# EAGLE design RQ2_mainboard_v0.2 (EAGLE 7.7.0)
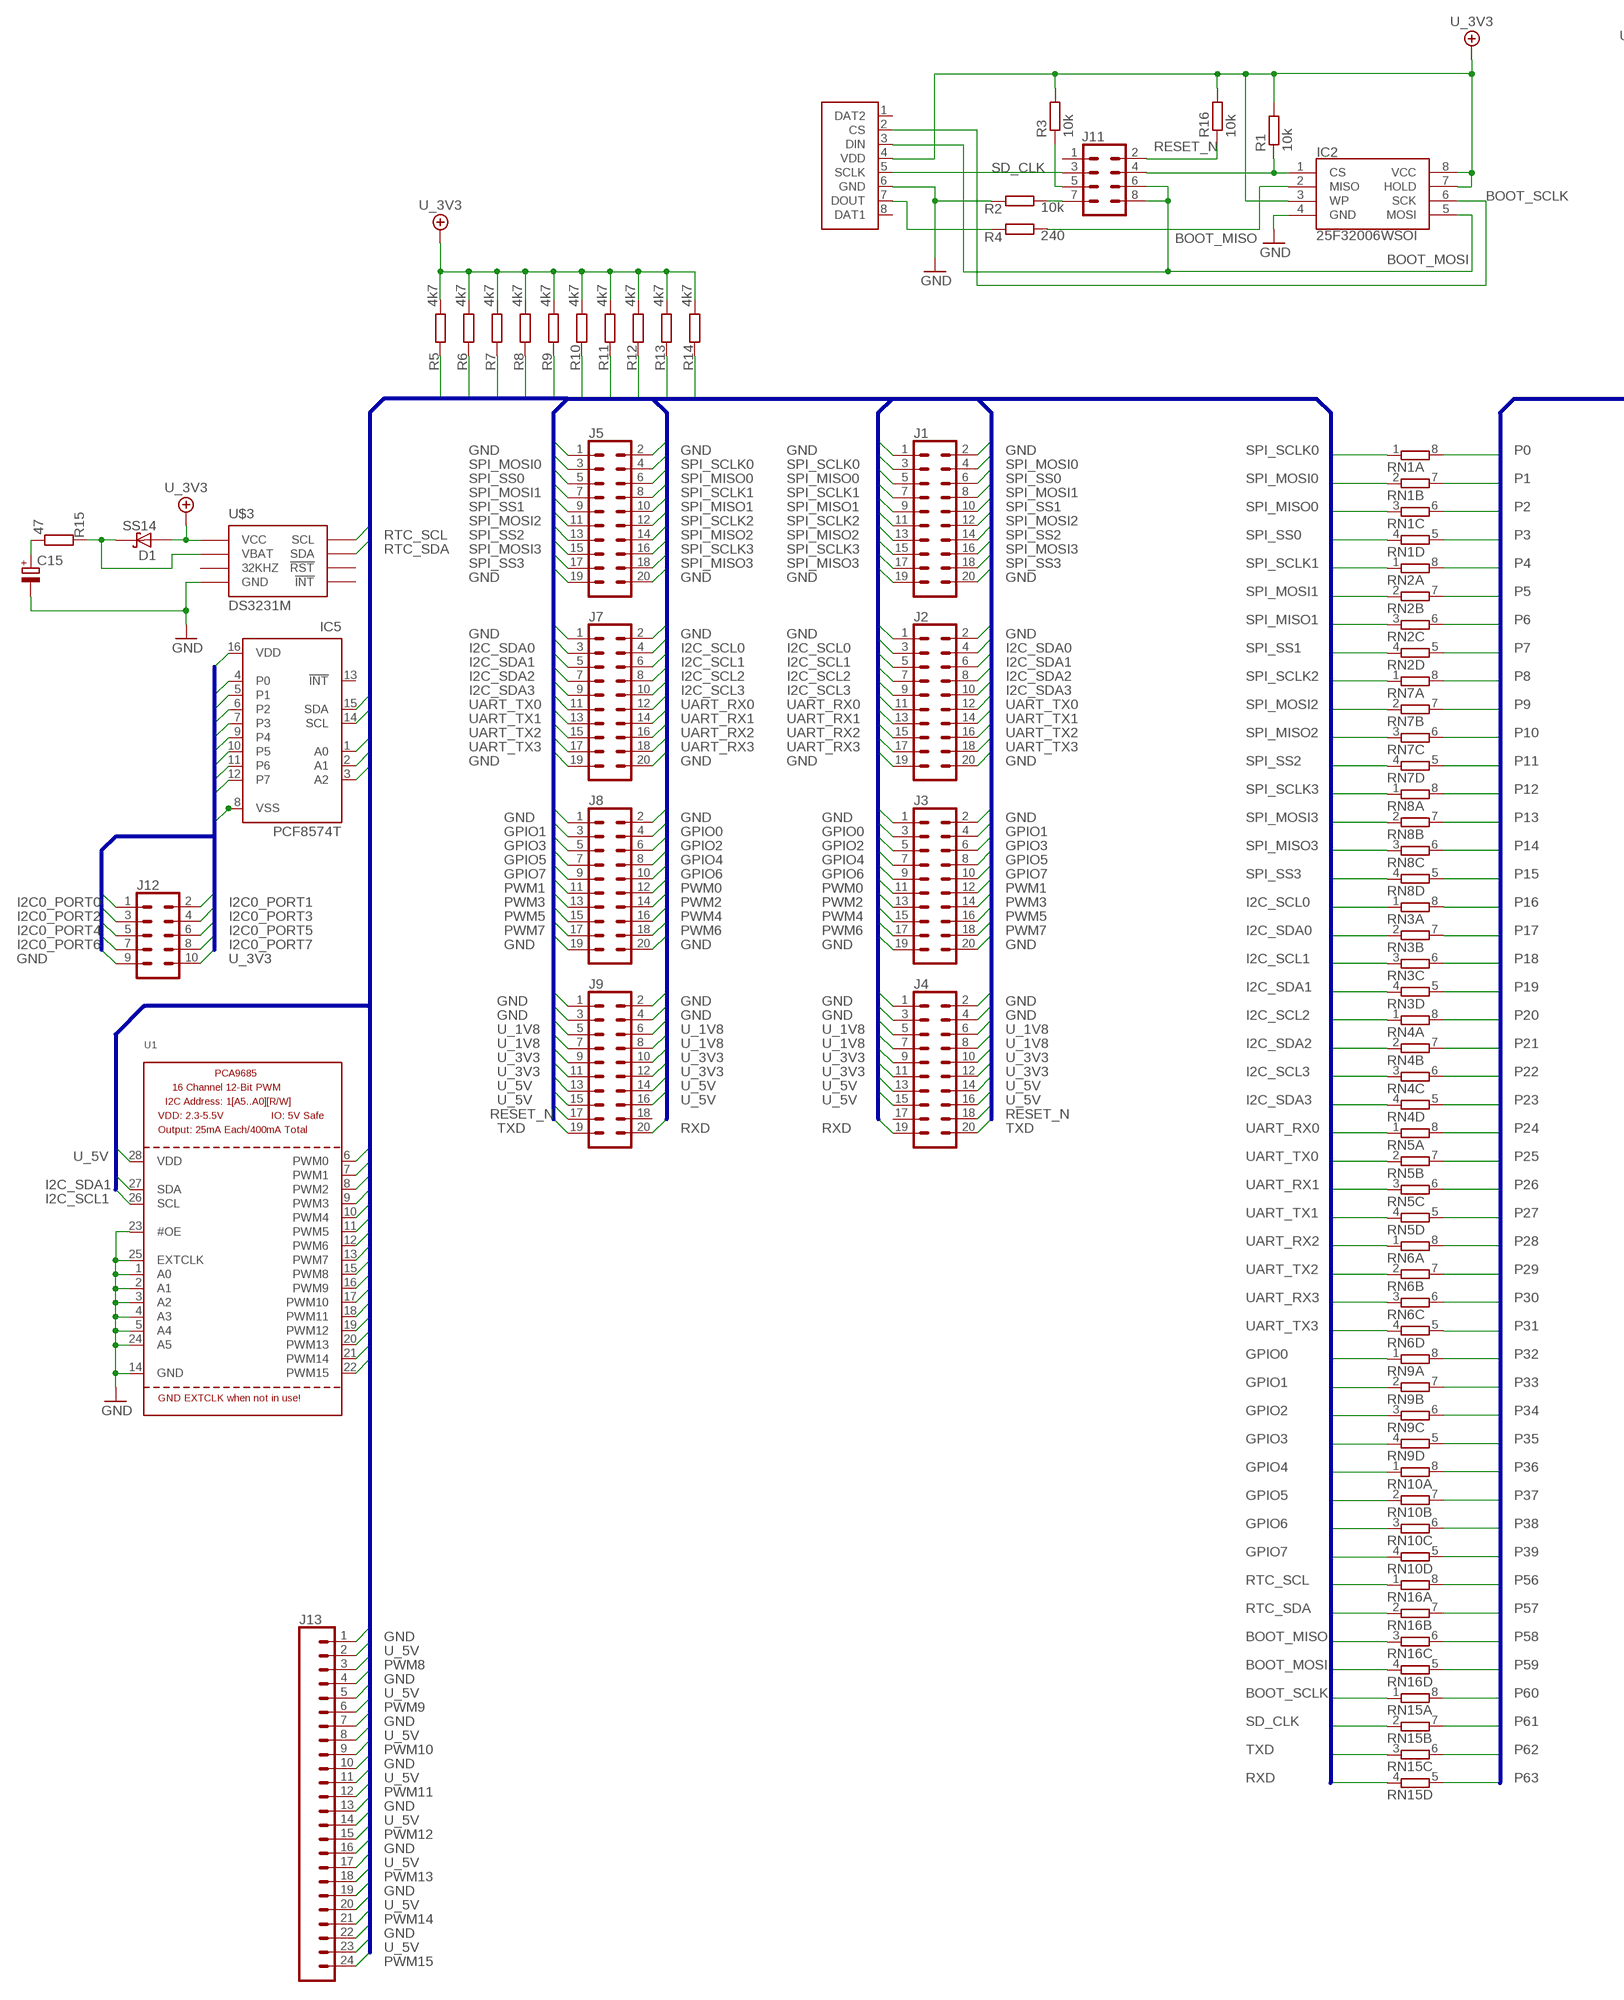
[diagram p0: schematic, sheet 1, part 1 of 2]
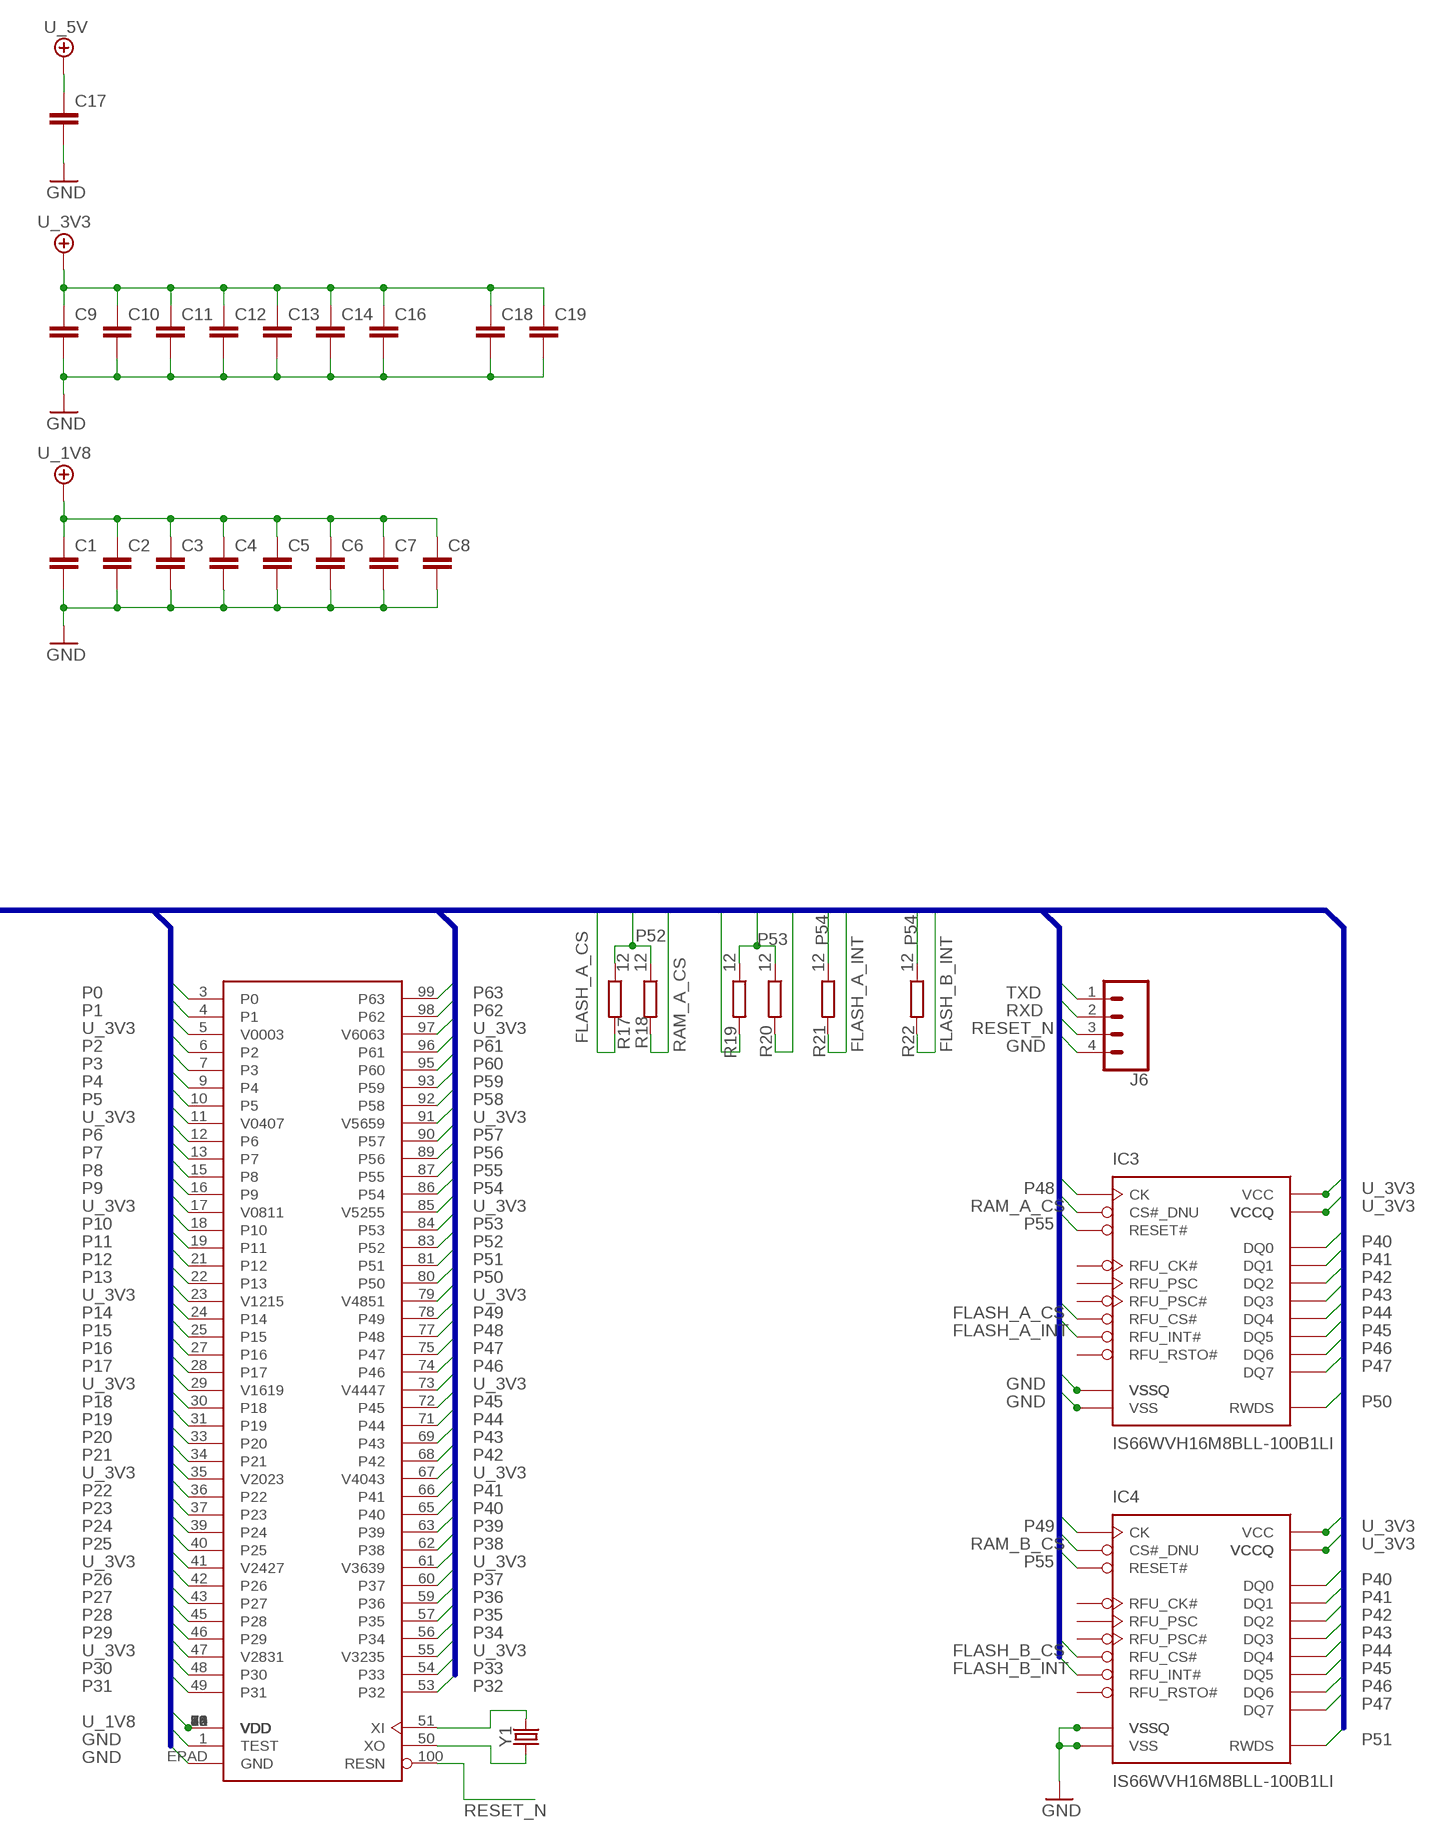
[diagram p1: schematic, sheet 1, part 2 of 2]

## Parts
C1  C-EUC0805  [C0805]
C2  C-EUC0805  [C0805]
C3  C-EUC0805  [C0805]
C4  C-EUC0805  [C0805]
C5  C-EUC0805  [C0805]
C6  C-EUC0805  [C0805]
C7  C-EUC0805  [C0805]
C8  C-EUC0805  [C0805]
C9  C-EUC0805  [C0805]
C10  C-EUC0805  [C0805]
C11  C-EUC0805  [C0805]
C12  C-EUC0805  [C0805]
C13  C-EUC0805  [C0805]
C14  C-EUC0805  [C0805]
C15  CPOL-EUDHL_21.5  [DHL_21.5]
C16  C-EUC0805  [C0805]
C17  C-EUC0805  [C0805]
C18  C-EUC0805  [C0805]
C19  C-EUC0805  [C0805]
D1  SS14  [SMA_403D]
IC1  P2X8C4M64P  [TQFP100]
IC2  25F32006WSOI  SPI_FLASH-X25XXSMD1  [SO08-EIAJ]
IC3  IS66WVH16M8BLL-100B1LI  [BGA-24]
IC4  IS66WVH16M8BLL-100B1LI  [BGA-24]
IC5  PCF8574T  [SO16W]
J1  CONN_10X2SMT  [2X10_SMT]
J2  CONN_10X2SMT  [2X10_SMT]
J3  CONN_10X2SMT  [2X10_SMT]
J4  CONN_10X2SMT  [2X10_SMT]
J5  CONN_10X2SMT  [2X10_SMT]
J6  CONN_04  [1X04]
J7  CONN_10X2SMT  [2X10_SMT]
J8  CONN_10X2SMT  [2X10_SMT]
J9  CONN_10X2SMT  [2X10_SMT]
J11  CONN_04X2  [2X4]
J12  CONN_05X2SHD  [2X5-SHROUDED]
J13  CONN_24SERVO_8  [3X8]
R1  10k  R-EU_R0603  [R0603]
R2  10k  R-EU_R0603  [R0603]
R3  10k  R-EU_R0603  [R0603]
R4  240  R-EU_R0603  [R0603]
R5  4k7  R-EU_R0603  [R0603]
R6  4k7  R-EU_R0603  [R0603]
R7  4k7  R-EU_R0603  [R0603]
R8  4k7  R-EU_R0603  [R0603]
R9  4k7  R-EU_R0603  [R0603]
R10  4k7  R-EU_R0603  [R0603]
R11  4k7  R-EU_R0603  [R0603]
R12  4k7  R-EU_R0603  [R0603]
R13  4k7  R-EU_R0603  [R0603]
R14  4k7  R-EU_R0603  [R0603]
R15  47  R-EU_R0603  [R0603]
R16  10k  R-EU_R0603  [R0603]
R17  12  R-EU_R0402  [R0402]
R18  12  R-EU_R0402  [R0402]
R19  12  R-EU_R0402  [R0402]
R20  12  R-EU_R0402  [R0402]
R21  12  R-EU_R0402  [R0402]
R22  12  R-EU_R0402  [R0402]
RN1  4R-N0603-ARV  [0603-ARV]
RN2  4R-N0603-ARV  [0603-ARV]
RN3  4R-N0603-ARV  [0603-ARV]
RN4  4R-N0603-ARV  [0603-ARV]
RN5  4R-N0603-ARV  [0603-ARV]
RN6  4R-N0603-ARV  [0603-ARV]
RN7  4R-N0603-ARV  [0603-ARV]
RN8  4R-N0603-ARV  [0603-ARV]
RN9  4R-N0603-ARV  [0603-ARV]
RN10  4R-N0603-ARV  [0603-ARV]
RN15  4R-N0603-ARV  [0603-ARV]
RN16  4R-N0603-ARV  [0603-ARV]
U1  PCA9685  [TSSOP28]
U$2  MICRO_SD_CONNECTORMOLEX_HINGE  [MICRO_SD]
U$3  DS3231M  [SO-8]
Y1  CRYSTALSMD-5X3.2-2PAD  [CRYSTAL-SMD-5X3.2-2PAD]

## Nets
BOOT_MISO: IC2.2(MISO) R4.1 RN16.3
BOOT_MOSI: IC2.5(MOSI) J11.6 J11.8 RN16.4 U$2.3(DIN)
BOOT_SCLK: IC2.6(SCK) RN15.1 U$2.2(CS)
FLASH_A_CS: IC3.C2(RFU_CS#) R17.2
FLASH_A_INT: IC3.A5(RFU_INT#) R21.2
FLASH_B_CS: IC4.C2(RFU_CS#) R19.2
FLASH_B_INT: IC4.A5(RFU_INT#) R22.2
FLASH_CS: IC2.1(CS) J11.4 R1.1
GND: C1.2 C2.2 C3.2 C4.2 C5.2 C6.2 C7.2 C8.2 C9.2 C10.2 C11.2 C12.2 C13.2 C14.2 C15.- C16.2 C17.2 C18.2 C19.2 IC1.1(TEST) IC1.EPAD(GND) IC2.4(GND) IC3.B3(VSS) IC3.C1(VSSQ) IC3.E5(VSSQ) IC4.B3(VSS) IC4.C1(VSSQ) IC4.E5(VSSQ) IC5.1(A0) IC5.2(A1) IC5.3(A2) IC5.8(VSS) J1.1 J1.2 J1.19 J1.20 J2.1 J2.2 J2.19 J2.20 J3.1 J3.2 J3.19 J3.20 J4.1 J4.2 J4.3 J4.4 J5.1 J5.2 J5.19 J5.20 J6.4 J7.1 J7.2 J7.19 J7.20 J8.1 J8.2 J8.19 J8.20 J9.1 J9.2 J9.3 J9.4 J12.9 J13.1 J13.4 J13.7 J13.10 J13.13 J13.16 J13.19 J13.22 R2.2 U1.1(A0) U1.2(A1) U1.3(A2) U1.4(A3) U1.5(A4) U1.14(GND) U1.23(#OE) U1.24(A5) U1.25(EXTCLK) U$2.6(GND) U$3.5(GND)
GPIO0: J3.3 J8.4 RN9.1
GPIO1: J3.4 J8.3 RN9.2
GPIO2: J3.5 J8.6 RN9.3
GPIO3: J3.6 J8.5 RN9.4
GPIO4: J3.7 J8.8 RN10.1
GPIO5: J3.8 J8.7 RN10.2
GPIO6: J3.9 J8.10 RN10.3
GPIO7: J3.10 J8.9 RN10.4
I2C0_PORT0: IC5.4(P0) J12.1
I2C0_PORT1: IC5.5(P1) J12.2
I2C0_PORT2: IC5.6(P2) J12.3
I2C0_PORT3: IC5.7(P3) J12.4
I2C0_PORT4: IC5.9(P4) J12.5
I2C0_PORT5: IC5.10(P5) J12.6
I2C0_PORT6: IC5.11(P6) J12.7
I2C0_PORT7: IC5.12(P7) J12.8
I2C_SCL0: IC5.14(SCL) J2.3 J7.4 R5.1 RN3.1
I2C_SCL1: J2.5 J7.6 R7.1 RN3.3 U1.26(SCL)
I2C_SCL2: J2.7 J7.8 R9.1 RN4.1
I2C_SCL3: J2.9 J7.10 R11.1 RN4.3
I2C_SDA0: IC5.15(SDA) J2.4 J7.3 R6.1 RN3.2
I2C_SDA1: J2.6 J7.5 R8.1 RN3.4 U1.27(SDA)
I2C_SDA2: J2.8 J7.7 R10.1 RN4.2
I2C_SDA3: J2.10 J7.9 R12.1 RN4.4
N$7: J11.7 R2.1
N$8: J11.5 R3.1
N$10: R4.2 U$2.7(DOUT)
P0: IC1.3(P0) RN1.8
P1: IC1.4(P1) RN1.7
P2: IC1.6(P2) RN1.6
P3: IC1.7(P3) RN1.5
P4: IC1.9(P4) RN2.8
P5: IC1.10(P5) RN2.7
P6: IC1.12(P6) RN2.6
P7: IC1.13(P7) RN2.5
P8: IC1.15(P8) RN7.8
P9: IC1.16(P9) RN7.7
P10: IC1.18(P10) RN7.6
P11: IC1.19(P11) RN7.5
P12: IC1.21(P12) RN8.8
P13: IC1.22(P13) RN8.7
P14: IC1.24(P14) RN8.6
P15: IC1.25(P15) RN8.5
P16: IC1.27(P16) RN3.8
P17: IC1.28(P17) RN3.7
P18: IC1.30(P18) RN3.6
P19: IC1.31(P19) RN3.5
P20: IC1.33(P20) RN4.8
P21: IC1.34(P21) RN4.7
P22: IC1.36(P22) RN4.6
P23: IC1.37(P23) RN4.5
P24: IC1.39(P24) RN5.8
P25: IC1.40(P25) RN5.7
P26: IC1.42(P26) RN5.6
P27: IC1.43(P27) RN5.5
P28: IC1.45(P28) RN6.8
P29: IC1.46(P29) RN6.7
P30: IC1.48(P30) RN6.6
P31: IC1.49(P31) RN6.5
P32: IC1.53(P32) RN9.8
P33: IC1.54(P33) RN9.7
P34: IC1.56(P34) RN9.6
P35: IC1.57(P35) RN9.5
P36: IC1.59(P36) RN10.8
P37: IC1.60(P37) RN10.7
P38: IC1.62(P38) RN10.6
P39: IC1.63(P39) RN10.5
P40: IC1.65(P40) IC3.D3(DQ0) IC4.D3(DQ0)
P41: IC1.66(P41) IC3.D2(DQ1) IC4.D2(DQ1)
P42: IC1.68(P42) IC3.C4(DQ2) IC4.C4(DQ2)
P43: IC1.69(P43) IC3.D4(DQ3) IC4.D4(DQ3)
P44: IC1.71(P44) IC3.D5(DQ4) IC4.D5(DQ4)
P45: IC1.72(P45) IC3.E3(DQ5) IC4.E3(DQ5)
P46: IC1.74(P46) IC3.E2(DQ6) IC4.E2(DQ6)
P47: IC1.75(P47) IC3.E1(DQ7) IC4.E1(DQ7)
P48: IC1.77(P48) IC3.B2(CK)
P49: IC1.78(P49) IC4.B2(CK)
P50: IC1.80(P50) IC3.C3(RWDS)
P51: IC1.81(P51) IC4.C3(RWDS)
P52: IC1.83(P52) R17.1 R18.1
P53: IC1.84(P53) R19.1 R20.1
P54: IC1.86(P54) R21.1 R22.1
P55: IC1.87(P55) IC3.A4(RESET#) IC4.A4(RESET#)
P56: IC1.89(P56) RN16.8
P57: IC1.90(P57) RN16.7
P58: IC1.92(P58) RN16.6
P59: IC1.93(P59) RN16.5
P60: IC1.95(P60) RN15.8
P61: IC1.96(P61) RN15.7
P62: IC1.98(P62) RN15.6
P63: IC1.99(P63) RN15.5
PWM0: J3.11 J8.12 U1.6(PWM0)
PWM1: J3.12 J8.11 U1.7(PWM1)
PWM2: J3.13 J8.14 U1.8(PWM2)
PWM3: J3.14 J8.13 U1.9(PWM3)
PWM4: J3.15 J8.16 U1.10(PWM4)
PWM5: J3.16 J8.15 U1.11(PWM5)
PWM6: J3.17 J8.18 U1.12(PWM6)
PWM7: J3.18 J8.17 U1.13(PWM7)
PWM8: J13.3 U1.15(PWM8)
PWM9: J13.6 U1.16(PWM9)
PWM10: J13.9 U1.17(PWM10)
PWM11: J13.12 U1.18(PWM11)
PWM12: J13.15 U1.19(PWM12)
PWM13: J13.18 U1.20(PWM13)
PWM14: J13.21 U1.21(PWM14)
PWM15: J13.24 U1.22(PWM15)
RAM_A_CS: IC3.A3(CS#_DNU) R18.2
RAM_B_CS: IC4.A3(CS#_DNU) R20.2
RESET_N: IC1.100(RESN) J4.18 J6.3 J9.17 J11.2 R16.1
RTC_SCL: R13.1 RN16.1 U$3.8(SCL)
RTC_SDA: R14.1 RN16.2 U$3.7(SDA)
RXD: J4.19 J6.2 J9.20 RN15.4
SD_CLK: J11.3 RN15.2 U$2.5(SCLK)
SPI_MISO0: J1.5 J5.6 RN1.3
SPI_MISO1: J1.9 J5.10 RN2.3
SPI_MISO2: J1.13 J5.14 RN7.3
SPI_MISO3: J1.17 J5.18 RN8.3
SPI_MOSI0: J1.4 J5.3 RN1.2
SPI_MOSI1: J1.8 J5.7 RN2.2
SPI_MOSI2: J1.12 J5.11 RN7.2
SPI_MOSI3: J1.16 J5.15 RN8.2
SPI_SCLK0: J1.3 J5.4 RN1.1
SPI_SCLK1: J1.7 J5.8 RN2.1
SPI_SCLK2: J1.11 J5.12 RN7.1
SPI_SCLK3: J1.15 J5.16 RN8.1
SPI_SS0: J1.6 J5.5 RN1.4
SPI_SS1: J1.10 J5.9 RN2.4
SPI_SS2: J1.14 J5.13 RN7.4
SPI_SS3: J1.18 J5.17 RN8.4
TXD: J4.20 J6.1 J9.19 RN15.3
U_1V8: C1.1 C2.1 C3.1 C4.1 C5.1 C6.1 C7.1 C8.1 IC1.2(VDD) J4.5 J4.6 J4.7 J4.8 J9.5 J9.6 J9.7 J9.8
U_3V3: C9.1 C10.1 C11.1 C12.1 C13.1 C14.1 C16.1 C18.1 C19.1 D1.A IC1.5(V0003) IC1.11(V0407) IC1.17(V0811) IC1.23(V1215) IC1.29(V1619) IC1.35(V2023) IC1.41(V2427) IC1.47(V2831) IC1.55(V3235) IC1.61(V3639) IC1.67(V4043) IC1.73(V4447) IC1.79(V4851) IC1.85(V5255) IC1.91(V5659) IC1.97(V6063) IC2.3(WP) IC2.7(HOLD) IC2.8(VCC) IC3.B4(VCC) IC3.D1(VCCQ) IC3.E4(VCCQ) IC4.B4(VCC) IC4.D1(VCCQ) IC4.E4(VCCQ) IC5.16(VDD) J4.9 J4.10 J4.11 J4.12 J9.9 J9.10 J9.11 J9.12 J12.10 R1.2 R3.2 R5.2 R6.2 R7.2 R8.2 R9.2 R10.2 R11.2 R12.2 R13.2 R14.2 R16.2 U$2.4(VDD) U$3.2(VCC)
U_5V: C17.1 J4.13 J4.14 J4.15 J4.16 J9.13 J9.14 J9.15 J9.16 J13.2 J13.5 J13.8 J13.11 J13.14 J13.17 J13.20 J13.23 U1.28(VDD)
UART_RX0: J2.11 J7.12 RN5.1
UART_RX1: J2.13 J7.14 RN5.3
UART_RX2: J2.15 J7.16 RN6.1
UART_RX3: J2.17 J7.18 RN6.3
UART_TX0: J2.12 J7.11 RN5.2
UART_TX1: J2.14 J7.13 RN5.4
UART_TX2: J2.16 J7.15 RN6.2
UART_TX3: J2.18 J7.17 RN6.4
VBAT: D1.C R15.1 U$3.6(VBAT)
VCAP: C15.+ R15.2
XIN: IC1.51(XI) Y1.P$2
XOUT: IC1.50(XO) Y1.P$1
Unconnected: IC3.A2(RFU_RSTO#) IC3.B1(RFU_CK#) IC3.B5(RFU_PSC) IC3.C5(RFU_PSC#) IC4.A2(RFU_RSTO#) IC4.B1(RFU_CK#) IC4.B5(RFU_PSC) IC4.C5(RFU_PSC#) IC5.13(!INT) J4.17 J9.18 J11.1 U$2.1(DAT2) U$2.8(DAT1) U$3.1(32KHZ) U$3.3(!INT) U$3.4(!RST)

## Buses
P[0..63],RAM_A_CS,FLASH_A_CS,RAM_B_CS,FLASH_B_CS,FLASH_A_INT,FLASH_B_INT,SPI_SCLK[0..3],SPI_MOSI[0..3],SPI_MISO[0..3],SPI_SS[0..3],I2C_SCL[0..3],I2C_SDA[0..3],SD0_CLK,SD0_CMD,SD0_DAT[0..3],SD1_CLK,SD1_CMD,SD1_DAT[0..3],GPIO[0..15],PWM[0..7],UART_RX[0..3],UART_TX[0..3],RXD,TXD,BOOT_SCLK,BOOT_MISO,BOOT_MOSI,SD_CLK,RESET_N,XIN,XOUT,U_1V8,U_3V3,U_5V,U_IN,GND
SPI_SCLK[0..3],SPI_MOSI[0..3],SPI_MISO[0..3],SPI_SS[0..3],I2C_SCL[0..3],I2C_SDA[0..3],RTC_SCL,RTC_SDA,SD_CLK,SD_CMD,SD_DAT[0..3],GPIO[0..7],ADC[0..7],PWM[0..15],UART_RX[0..3],UART_TX[0..3],PORT[0..7],RXD,TXD,BOOT_SCLK,BOOT_MISO,BOOT_MOSI,RESET_N,XIN,XOUT,U_1V8,U_3V3,U_5V,U_IN,GND
I2C0_PORT[0..7],U_3V3,GND

## Power pins joined to a net without a drawn wire
U_1V8: IC1.8(VDD) IC1.14(VDD) IC1.20(VDD) IC1.26(VDD) IC1.32(VDD) IC1.38(VDD) IC1.44(VDD) IC1.52(VDD) IC1.58(VDD) IC1.64(VDD) IC1.70(VDD) IC1.76(VDD) IC1.82(VDD) IC1.88(VDD) IC1.94(VDD)

## Library data of the parts
C1-C14 C16-C19 = rcl:C-EU: CAPACITOR, European symbol
C15 = rcl_updated:CPOL-EU: POLARIZED CAPACITOR, European symbol
D1 = adafruit:SS14
IC1 = parallax:P2X8C4M64P
IC2 = SparkFun-IC-Memory:SPI_FLASH-X25XX: 32M Serial Flash Memory 8pin SPI Flash series x25xx. Works with devices like W25X32 and BR25L32 Datasheet <http://www.macronix.com/Lists/Datasheet/Attachments/5031/MX25L3206E,%203V,%2032Mb,%20v1.5.pdf> SparkFun Products SparkFun Venus GPS Logger <https://www.sparkfun.com/products/10920> (GPS-10920); PROD_ID: IC-09109
IC3 IC4 = parallax:IS66WVH16M8BLL-100B1LI
IC5 = micro-philips:PCF8574: I2C-Bus Remote 8-bit I/O expander http://www.semiconductors.philips.com/acrobat_download/datasheets/PCF8574_4.pdf; MPN: PCF8574T/3,512; OC_FARNELL: 1201255; OC_NEWARK: 70R6870
J1-J5 J7-J9 = SparkFun-Connectors:CONN_10X2: Multi connection point. Often used as Generic Header-pin footprint for 0.1 inch spaced/style header connections On any of the 0.1 inch spaced packages, you can populate with these: Break Away Headers - Straight <https://www.sparkfun.com/products/116> (PRT-00116) Break Away Male Headers - Right Angle <https://www.sparkfun.com/products/553> (PRT-00553) Female Headers <https://www.sparkfun.com/products/115> (PRT-00115) Break Away Headers - Machine Pin <https://www.sparkfun.com/products/117> (PRT-00117) Break Away Female Headers - Swiss Machine Pin <https://www.sparkfun.com/products/743> (PRT-00743) Special note about the "SPECIAL" package: This was SPECIALLY designed to be used with our Graphic LCD Backpack. Be sure you want to use this! It is not only staggered on each line of header holes, but IT IS ALSO offset of the center point of the top and bottom lines by 5 mil. This causes the headers to lock into place on the "standard" footprint on the LCD screen. The extra squares on the tdocu layer are there simply to reference other pins (if you were to actually populate a longer header than ten long - this is what we do with the backpacks).
J6 = SparkFun-Connectors:CONN_04: Multi connection point. Often used as Generic Header-pin footprint for 0.1 inch spaced/style header connections On any of the 0.1 inch spaced packages, you can populate with these: Break Away Headers - Straight <https://www.sparkfun.com/products/116> (PRT-00116) Break Away Male Headers - Right Angle <https://www.sparkfun.com/products/553> (PRT-00553) Female Headers <https://www.sparkfun.com/products/115> (PRT-00115) Break Away Headers - Machine Pin <https://www.sparkfun.com/products/117> (PRT-00117) Break Away Female Headers - Swiss Machine Pin <https://www.sparkfun.com/products/743> (PRT-00743) For SCREWTERMINALS and SPRING TERMINALS visit here: Screw Terimnals on SparkFun.com <https://www.sparkfun.com/search/results?term=Screw+Terminals> (5mm/3.5mm/2.54mm spacing) This device is also useful as a general connection point to wire up your design to another part of your project. Our various solder wires solder well into these plated through hole pads. Hook-Up Wire - Assortment (Stranded, 22 AWG) <https://www.sparkfun.com/products/11375> (PRT-11375) Hook-Up Wire - Assortment (Solid Core, 22 AWG) <https://www.sparkfun.com/products/11367> (PRT-11367) View the entire wire category on our website here <https://www.sparkfun.com/categories/141> Special notes: Molex polarized connector foot print use with SKU : PRT-08231 with associated crimp pins and housings. 1MM SMD Version SKU: PRT-10208; PROD_ID: CONN-09696
J11 = SparkFun-Connectors:CONN_04X2: Multi connection point. Often used as Generic Header-pin footprint for 0.1 inch spaced/style header connections On any of the 0.1 inch spaced packages, you can populate with these: Break Away Headers - Straight <https://www.sparkfun.com/products/116> (PRT-00116) Break Away Male Headers - Right Angle <https://www.sparkfun.com/products/553> (PRT-00553) Female Headers <https://www.sparkfun.com/products/115> (PRT-00115) Break Away Headers - Machine Pin <https://www.sparkfun.com/products/117> (PRT-00117) Break Away Female Headers - Swiss Machine Pin <https://www.sparkfun.com/products/743> (PRT-00743)
J12 = SparkFun-Connectors:CONN_05X2: Multi connection point. Often used as Generic Header-pin footprint for 0.1 inch spaced/style header connections For AVR SPI programming port, see special device with nice symbol: "AVR_SPI_PROG_5x2.dev" You can populate with any combo of single row headers, but if you'd like an exact match, check these: 2x5 AVR ICSP Male Header <https://www.sparkfun.com/products/778> (PRT-00778) 2x5 Pin Shrouded Header <https://www.sparkfun.com/products/8506> (PRT-08506) On any of the 0.1 inch spaced packages, you can populate with these: Break Away Headers - Straight <https://www.sparkfun.com/products/116> (PRT-00116) Break Away Male Headers - Right Angle <https://www.sparkfun.com/products/553> (PRT-00553) Female Headers <https://www.sparkfun.com/products/115> (PRT-00115) Break Away Headers - Machine Pin <https://www.sparkfun.com/products/117> (PRT-00117) Break Away Female Headers - Swiss Machine Pin <https://www.sparkfun.com/products/743> (PRT-00743) Special note: the shrouded connector mates well with our 5x2 ribbon cables: 2x5 Pin IDC Ribbon Cable <https://www.sparkfun.com/products/8535> (PRT-08535); PROD_ID: CONN-08671; SF_ID: PRT-08506
J13 = SparkFun-Connectors:CONN_24: Multi connection point. Often used as Generic Header-pin footprint for 0.1 inch spaced/style header connections On any of the 0.1 inch spaced packages, you can populate with these: Break Away Headers - Straight <https://www.sparkfun.com/products/116> (PRT-00116) Break Away Male Headers - Right Angle <https://www.sparkfun.com/products/553> (PRT-00553) Female Headers <https://www.sparkfun.com/products/115> (PRT-00115) Break Away Headers - Machine Pin <https://www.sparkfun.com/products/117> (PRT-00117) Break Away Female Headers - Swiss Machine Pin <https://www.sparkfun.com/products/743> (PRT-00743) For SCREWTERMINALS and SPRING TERMINALS visit here: Screw Terimnals on SparkFun.com <https://www.sparkfun.com/search/results?term=Screw+Terminals> (5mm/3.5mm/2.54mm spacing) This device is also useful as a general connection point to wire up your design to another part of your project. Our various solder wires solder well into these plated through hole pads. Hook-Up Wire - Assortment (Stranded, 22 AWG) <https://www.sparkfun.com/products/11375> (PRT-11375) Hook-Up Wire - Assortment (Solid Core, 22 AWG) <https://www.sparkfun.com/products/11367> (PRT-11367) View the entire wire category on our website here <https://www.sparkfun.com/categories/141> Special notes: Molex polarized connector foot print use with SKU : PRT-08231 with associated crimp pins and housings. 1MM SMD Version SKU: PRT-10208 NOTES ON THE VARIANTS LOCK and LOCK_LONGPADS... This footprint was designed to help hold the alignment of a through-hole component (i.e. 6-pin header) while soldering it into place. You may notice that each hole has been shifted either up or down by 0.005 of an inch from it's more standard position (which is a perfectly straight line). This slight alteration caused the pins (the squares in the middle) to touch the edges of the holes. Because they are alternating, it causes a "brace" to hold the component in place. 0.005 has proven to be the perfect amount of "off-center" position when using our standard breakaway headers. Although looks a little odd when you look at the bare footprint, once you have a header in there, the alteration is very hard to notice. Also,if you push a header all the way into place, it is covered up entirely on the bottom side.
R1-R22 = rcl:R-EU_: RESISTOR, European symbol
RN1-RN10 RN15 RN16 = resistor-dil:4R-N: Array Chip Resistor Source: RS Component / Phycomp; OC_FARNELL: unknown; OC_NEWARK: unknown
U1 = adafruit:PCA9685: PCA9685 - 16 Channel 12-Bit I2C PWM Controller 5.0V tolerant 16 channel, 12-bit I2C PWM controller with 25mA per output (max. 400mA total) Digikey: 568-5931-1-ND
U$2 = connector:MICRO_SD_CONNECTOR
U$3 = DS3231:DS3231M
Y1 = SparkFun-Clocks:CRYSTAL: Crystals (Generic) These are passive quartz crystals, which can be used as a clock source for a microcontroller. Crystal's are two-terminal devices. They require external "load" capacitors to generate an oscillating signal.

## Board
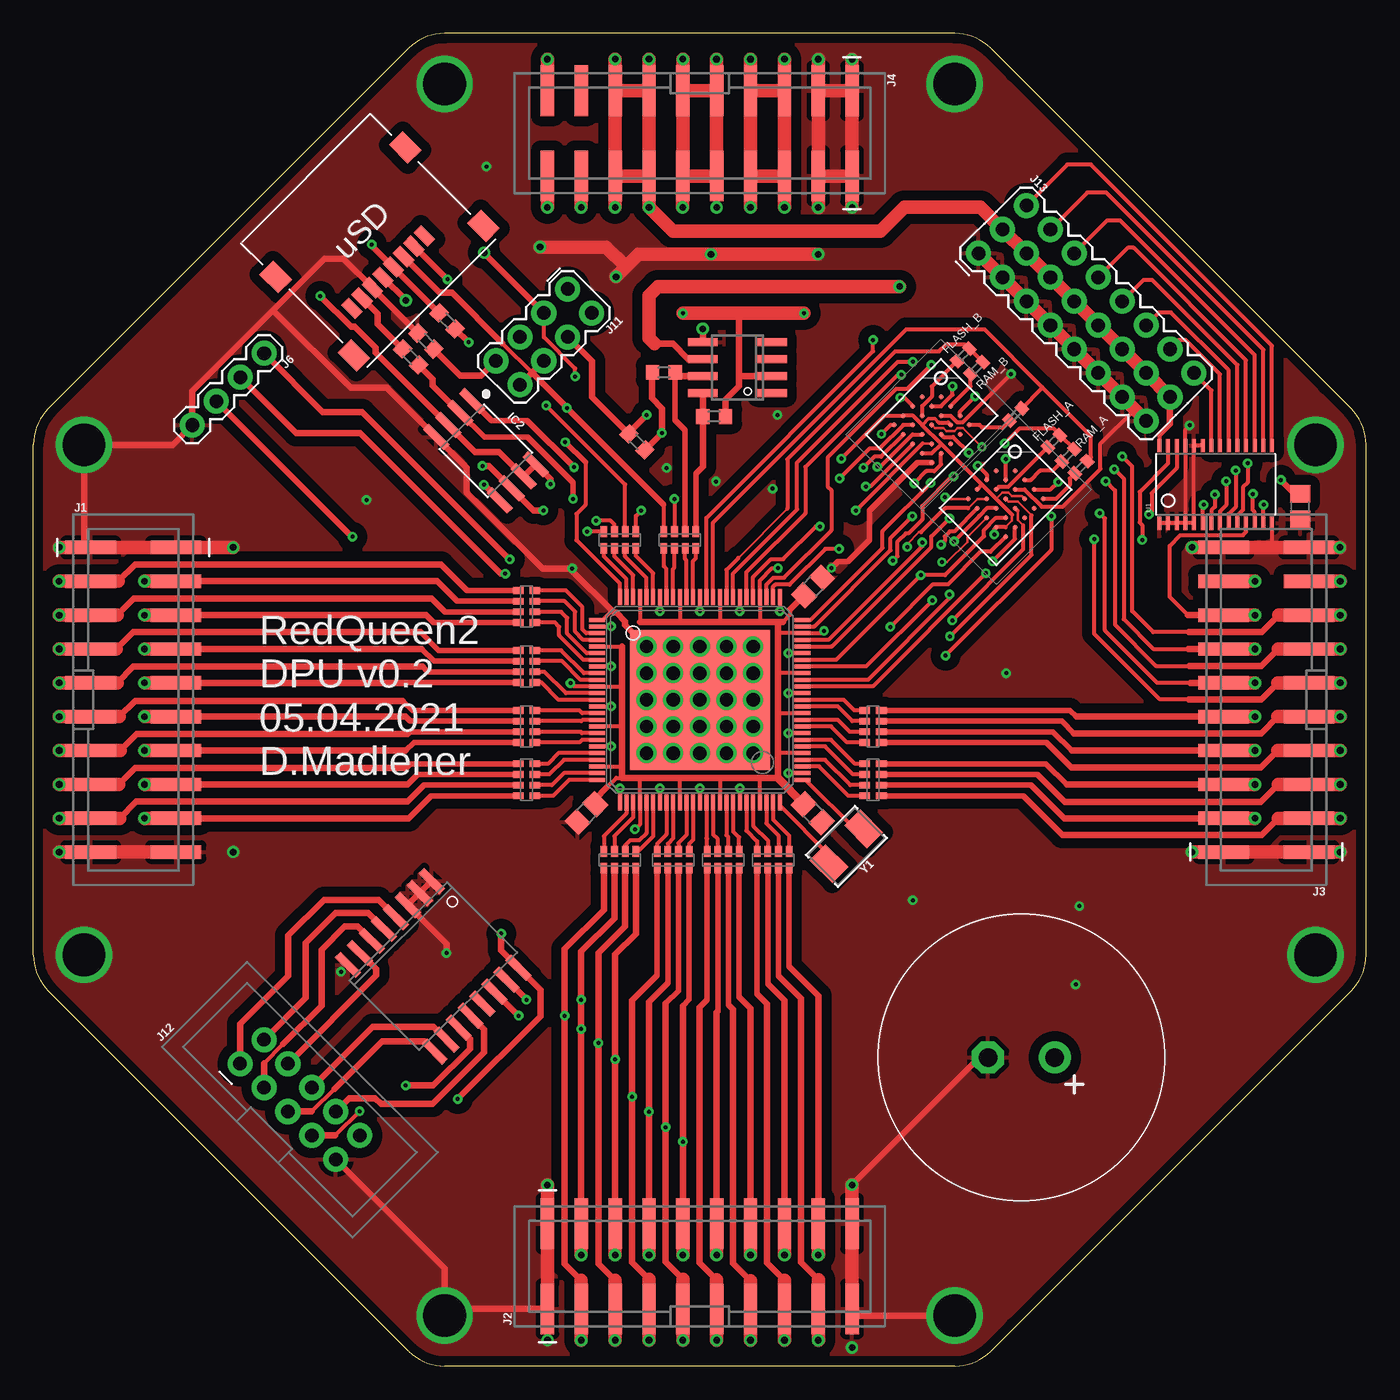
[diagram p2: board, top side]
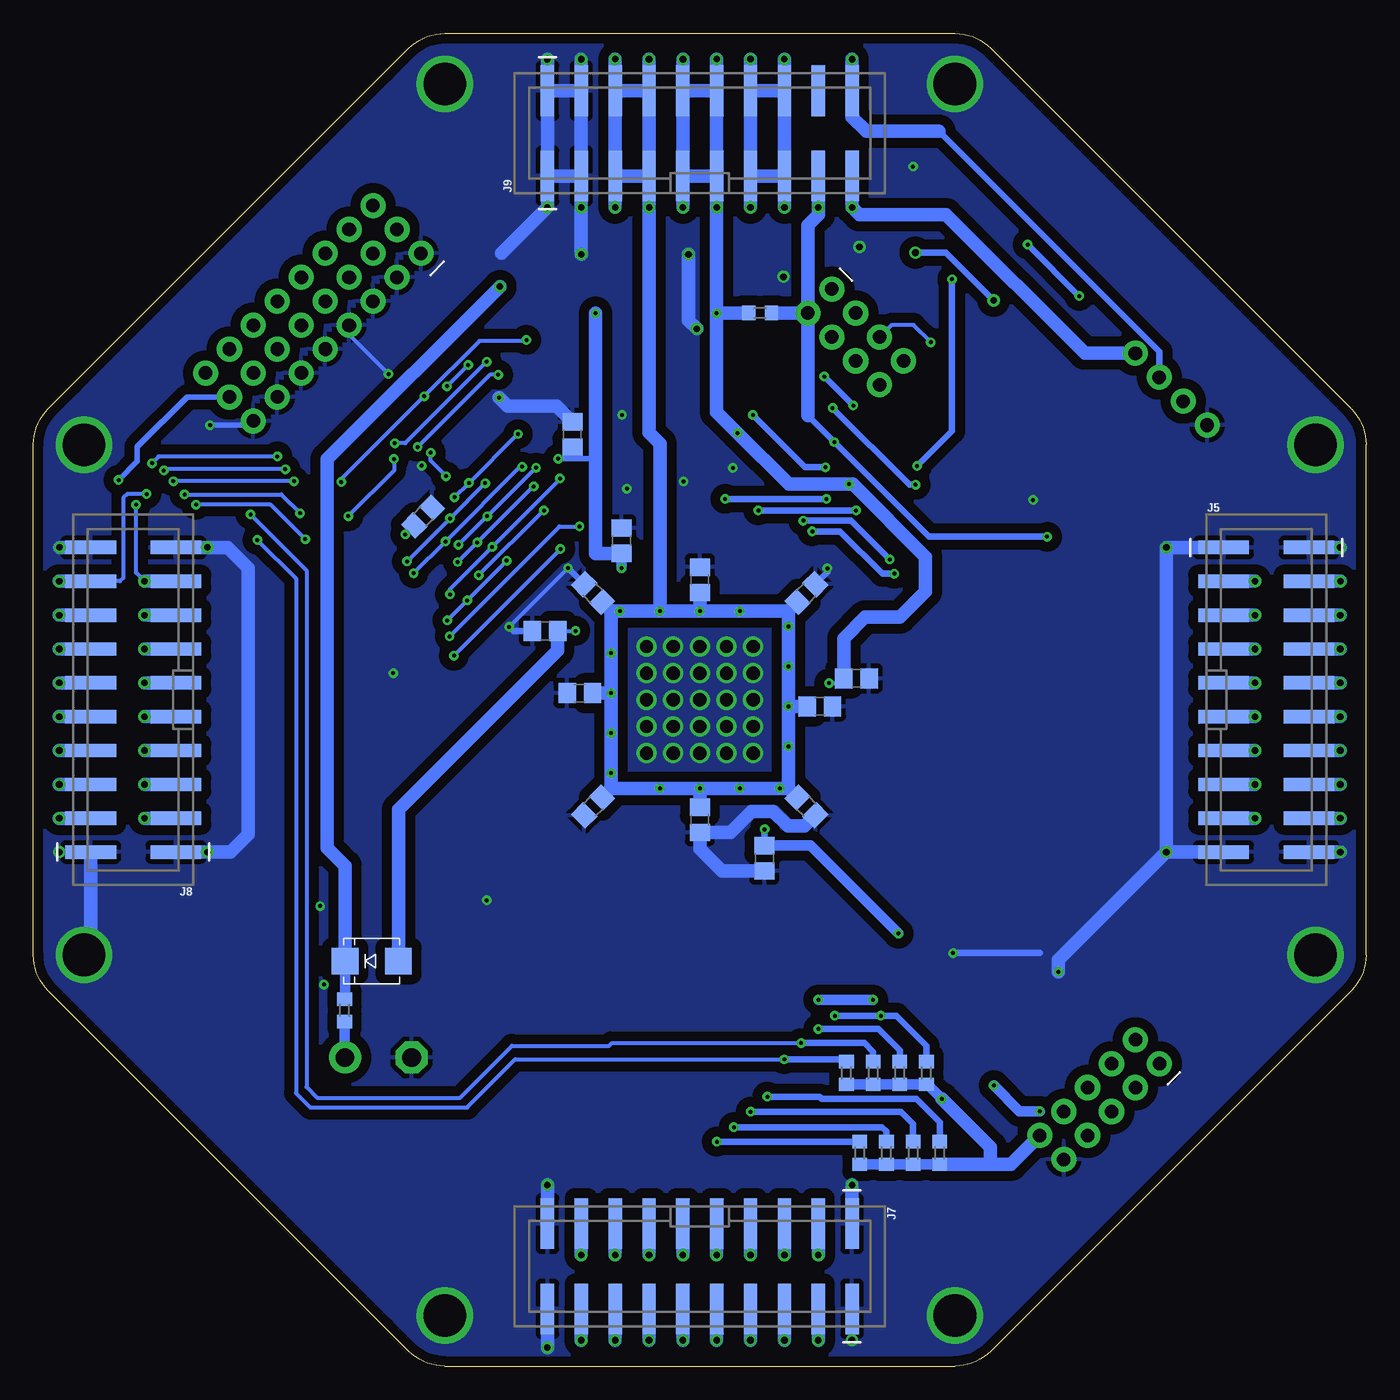
[diagram p3: board, bottom side, seen from below]

Size 100 x 100 mm. Coordinates in mm from the lower left corner, seen from the top.
Outline: 73.64,2.93 73.64,2.93
Outline: 97.07,73.64 97.07,73.64
Outline: 73.64,97.07 73.64,97.07
Outline: 98.89,28.17 arc45 100,30.86 100,69.14 arc45 98.89,71.83 71.83,98.89 arc45 69.13,100 30.86,100 arc45 28.17,98.89 1.11,71.83 arc45 0,69.14 0,30.87 arc45 1.11,28.18 28.18,1.11 arc45 30.87,0 69.13,0 arc45 71.83,1.11 98.89,28.17
Copper layers (1*16): Top 0.035mm / dielectric 1.5mm / Bottom 0.035mm
Design rules "default *": minimum track width 0.2mm, minimum drill 0.3mm, track to track 6mil, track to pad 6mil, pad to pad 6mil, via to via 6mil, smd to smd 6mil, copper to edge 6mil, drill to drill 6mil, minimum pad ring 10mil, minimum via ring 8mil, stop-mask expansion 4mil, vias tented up to drill 0mil, thermal gap 15mil

### Footprints (pad centres in the part's own frame; a part is rotated, then mirrored left to right if it is on the bottom)
C0805 = smd 1.3 x 1.5: 1 -0.95,0; 2 0.95,0
DHL_21.5 = drill 1.4 pad 2.4: + -2.5,0 | drill 1.4 pad 2.4 octagon: - 2.5,0
SMA_403D = smd 2 x 2: A 2,0; C -2,0
TQFP100 = smd 1.2 x 0.3: 1 -7.7,6; 2 -7.7,5.5; 3 -7.7,5; 4 -7.7,4.5; 5 -7.7,4; 6 -7.7,3.5; 7 -7.7,3; 8 -7.7,2.5; 9 -7.7,2; 10 -7.7,1.5; 11 -7.7,1; 12 -7.7,0.5; 13 -7.7,0; 14 -7.7,-0.5; 15 -7.7,-1; 16 -7.7,-1.5; 17 -7.7,-2; 18 -7.7,-2.5; 19 -7.7,-3; 20 -7.7,-3.5; 21 -7.7,-4; 22 -7.7,-4.5; 23 -7.7,-5; 24 -7.7,-5.5; 25 -7.7,-6; 51 7.7,-6; 52 7.7,-5.5; 53 7.7,-5; 54 7.7,-4.5; 55 7.7,-4; 56 7.7,-3.5; 57 7.7,-3; 58 7.7,-2.5; 59 7.7,-2; 60 7.7,-1.5; 61 7.7,-1; 62 7.7,-0.5; 63 7.7,0; 64 7.7,0.5; 65 7.7,1; 66 7.7,1.5; 67 7.7,2; 68 7.7,2.5; 69 7.7,3; 70 7.7,3.5; 71 7.7,4; 72 7.7,4.5; 73 7.7,5; 74 7.7,5.5; 75 7.7,6 | smd 0.3 x 1.2: 26 -6,-7.7; 27 -5.5,-7.7; 28 -5,-7.7; 29 -4.5,-7.7; 30 -4,-7.7; 31 -3.5,-7.7; 32 -3,-7.7; 33 -2.5,-7.7; 34 -2,-7.7; 35 -1.5,-7.7; 36 -1,-7.7; 37 -0.5,-7.7; 38 0,-7.7; 39 0.5,-7.7; 40 1,-7.7; 41 1.5,-7.7; 42 2,-7.7; 43 2.5,-7.7; 44 3,-7.7; 45 3.5,-7.7; 46 4,-7.7; 47 4.5,-7.7; 48 5,-7.7; 49 5.5,-7.7; 50 6,-7.7; 76 6,7.7; 77 5.5,7.7; 78 5,7.7; 79 4.5,7.7; 80 4,7.7; 81 3.5,7.7; 82 3,7.7; 83 2.5,7.7; 84 2,7.7; 85 1.5,7.7; 86 1,7.7; 87 0.5,7.7; 88 0,7.7; 89 -0.5,7.7; 90 -1,7.7; 91 -1.5,7.7; 92 -2,7.7; 93 -2.5,7.7; 94 -3,7.7; 95 -3.5,7.7; 96 -4,7.7; 97 -4.5,7.7; 98 -5,7.7; 99 -5.5,7.7; 100 -6,7.7 | smd 10.5 x 10.5: EPAD 0,0
SO08-EIAJ = smd 0.61 x 2.21: 1 -1.905,-3.378; 2 -0.635,-3.378; 3 0.635,-3.378; 4 1.905,-3.378; 5 1.905,3.353; 6 0.635,3.353; 7 -0.635,3.353; 8 -1.905,3.353
BGA-24 = smd 0.37 x 0.37: A2 -1,2; A3 0,2; A4 1,2; A5 2,2; B1 -2,1; B2 -1,1; B3 0,1; B4 1,1; B5 2,1; C1 -2,0; C2 -1,0; C3 0,0; C4 1,0; C5 2,0; D1 -2,-1; D2 -1,-1; D3 0,-1; D4 1,-1; D5 2,-1; E1 -2,-2; E2 -1,-2; E3 0,-2; E4 1,-2; E5 2,-2
SO16W = smd 0.6 x 2.2: 1 -4.445,-4.6; 2 -3.175,-4.6; 3 -1.905,-4.6; 4 -0.635,-4.6; 5 0.635,-4.6; 6 1.905,-4.6; 7 3.175,-4.6; 8 4.445,-4.6; 9 4.445,4.6; 10 3.175,4.6; 11 1.905,4.6; 12 0.635,4.6; 13 -0.635,4.6; 14 -1.905,4.6; 15 -3.175,4.6; 16 -4.445,4.6
2X10_SMT = smd 3.8 x 1: 1 -3.2,11.43; 2 3.2,11.43; 3 -3.2,8.89; 4 3.2,8.89; 5 -3.2,6.35; 6 3.2,6.35; 7 -3.2,3.81; 8 3.2,3.81; 9 -3.2,1.27; 10 3.2,1.27; 11 -3.2,-1.27; 12 3.2,-1.27; 13 -3.2,-3.81; 14 3.2,-3.81; 15 -3.2,-6.35; 16 3.2,-6.35; 17 -3.2,-8.89; 18 3.2,-8.89; 19 -3.2,-11.43; 20 3.2,-11.43
1X04 = drill 1.016 pad 1.88: 1 0,0; 2 2.54,0; 3 5.08,0; 4 7.62,0
2X4 = drill 1.016 pad 1.88: 1 -3.81,-1.27; 2 -3.81,1.27; 3 -1.27,-1.27; 4 -1.27,1.27; 5 1.27,-1.27; 6 1.27,1.27; 7 3.81,-1.27; 8 3.81,1.27
2X5-SHROUDED = drill 1.016 pad 1.88: 1 -1.27,5.08; 2 1.27,5.08; 3 -1.27,2.54; 4 1.27,2.54; 5 -1.27,0; 6 1.27,0; 7 -1.27,-2.54; 8 1.27,-2.54; 9 -1.27,-5.08; 10 1.27,-5.08
3X8 = drill 1.016 pad 1.88: 1 -8.89,-2.54; 2 -8.89,0; 3 -8.89,2.54; 4 -6.35,-2.54; 5 -6.35,0; 6 -6.35,2.54; 7 -3.81,-2.54; 8 -3.81,0; 9 -3.81,2.54; 10 -1.27,-2.54; 11 -1.27,0; 12 -1.27,2.54; 13 1.27,-2.54; 14 1.27,0; 15 1.27,2.54; 16 3.81,-2.54; 17 3.81,0; 18 3.81,2.54; 19 6.35,-2.54; 20 6.35,0; 21 6.35,2.54; 22 8.89,-2.54; 23 8.89,0; 24 8.89,2.54
R0603 = smd 1 x 1.1: 1 -0.85,0; 2 0.85,0
R0402 = smd 0.7 x 0.9: 1 -0.65,0; 2 0.65,0
0603-ARV = smd 0.5 x 0.8: 1 -1.2,-0.625; 2 -0.4,-0.625; 3 0.4,-0.625; 4 1.2,-0.625; 5 1.2,0.625; 6 0.4,0.625; 7 -0.4,0.625; 8 -1.2,0.625
TSSOP28 = smd 0.305 x 0.991: 1 -4.225,-2.918; 2 -3.575,-2.918; 3 -2.925,-2.918; 4 -2.275,-2.918; 5 -1.625,-2.918; 6 -0.975,-2.918; 7 -0.325,-2.918; 8 0.325,-2.918; 9 0.975,-2.918; 10 1.625,-2.918; 11 2.275,-2.918; 12 2.925,-2.918; 13 3.575,-2.918; 14 4.225,-2.918; 15 4.225,2.918; 16 3.575,2.918; 17 2.925,2.918; 18 2.275,2.918; 19 1.625,2.918; 20 0.975,2.918; 21 0.325,2.918; 22 -0.325,2.918; 23 -0.975,2.918; 24 -1.625,2.918; 25 -2.275,2.918; 26 -2.925,2.918; 27 -3.575,2.918; 28 -4.225,2.918
MICRO_SD = smd 0.8 x 1.5: 1 3.6,9.35; 2 4.7,9.35; 3 5.8,9.35; 4 6.9,9.35; 5 8,9.35; 6 9.1,9.35; 7 10.2,9.35; 8 11.3,9.35 | smd 1.45 x 2: SHLD0 13.675,3.65; SHLD1 13.675,11.95; SHLD2 -0.075,11.95; SHLD3 -0.075,3.65
SO-8 = smd 0.6 x 2.2: 1 -1.905,-2.6; 2 -0.635,-2.6; 3 0.635,-2.6; 4 1.905,-2.6; 5 1.905,2.6; 6 0.635,2.6; 7 -0.635,2.6; 8 -1.905,2.6
CRYSTAL-SMD-5X3.2-2PAD = smd 1.7 x 2.4: P$1 1.85,0; P$2 -1.85,0

### Placement (x,y rotation side)
C1  58,42 225 bottom
C2  58,58 135 bottom
C3  42,42 315 bottom
C4  42,58 45 bottom
C5  50,41 270 bottom
C6  41,49.5 0 bottom
C7  50,59 90 bottom
C8  59,50.5 180 bottom
C9  58.48,41.49 315 top
C10  38.24,51.61 0 bottom
C11  41.5,41.5 225 top
C12  58.5,58.5 45 top
C13  45.15,38.1 270 bottom
C14  55.87,61.94 90 bottom
C15  74.12,23.16 180 top
C16  61.6,55.16 180 bottom
C17  95.05,64.5 270 top
C18  70.75,63.75 45 bottom
C19  59.55,69.9 90 bottom
D1  74.61,30.4 0 bottom
IC1  50,50 0 top
IC2  33.97,68.67 225 top
IC3  72.95,65.07 315 top
IC4  67.4,70.61 315 top
IC5  30,30 225 top
J1  7.5,50 0 top
J2  50,7.5 90 top
J3  92.5,50 180 top
J4  50,92.5 270 top
J5  7.5,50 0 bottom
J6  17.32,76 225 top
J7  50,7.5 270 bottom
J8  92.5,50 180 bottom
J9  50,92.5 90 bottom
J11  38.3,77.22 225 top
J12  20,20 45 top
J13  79,79 315 top
R1  45.28,69.34 315 top
R2  29.45,76.9 135 top
R3  31.05,78.42 135 top
R4  28.3,75.72 135 top
R5  33,22 270 bottom
R6  35,22 270 bottom
R7  37,22 270 bottom
R8  39,22 270 bottom
R9  32,16 270 bottom
R10  34,16 270 bottom
R11  36,16 270 bottom
R12  38,16 270 bottom
R13  51.08,71.25 0 top
R14  47.3,74.56 180 top
R15  76.64,26.7 270 bottom
R16  45.47,79.02 180 bottom
R17  76.57,69.41 225 top
R18  77.64,68.34 225 top
R19  69.77,75.87 225 top
R20  70.77,74.88 225 top
R21  78.6,67.45 225 top
R22  73.7,71.4 225 top
RN1  37,57 270 top
RN2  37,52.5 270 top
RN3  44,38 0 top
RN4  48,38 0 top
RN5  51.75,38 0 top
RN6  55.5,38 0 top
RN7  37,48 270 top
RN8  37,44 270 top
RN9  63,44 90 top
RN10  63,48 90 top
RN15  44,62 180 top
RN16  48.5,62 180 top
U1  88.71,66.16 0 top
U$2  25.27,93.96 225 top
U$3  52.83,74.92 90 top
Y1  61,39 225 top

### Tracks (layer width: path | path; a pad name or v marks a point on that pad's centre or on a via)
BOOT_MISO  (via drill 0.3)
  Top 0.3: v48.09,65.06 48.09,62.63 RN16.3
  Top 0.4: v40.49,65.06 40.49,66.28 37.09,69.69 33.85,69.69 IC2.2 | 29.96,73.58 IC2.2 | IC2.2
  Top 0.5: 29.96,73.58 29.96,74.06 | R4.1 29.96,74.06 | 29.96,74.06
  Bottom 0.5: v40.49,65.06 v48.09,65.06
BOOT_MOSI  (via drill 0.3)
  Top 0.3: RN16.4 47.3,64.64 47.29,64.64 | 35.17,76.76 37.44,74.49 | v40.03,71.91 v40.03,71.9 | 37.44,74.57 37.44,74.49 | 37.37,74.49 37.44,74.49
  Top 0.4: v40.03,71.9 47.29,64.64
  Top 0.5: 37.44,74.49 v40.03,71.91 | J11.6 37.44,74.57 | J11.8 37.37,74.49 | 35.17,76.76 31.4,80.53 30.49,80.53 U$2.3 | IC2.5 v33.82,66.14 v33.81,66.14
  Bottom 0.5: v40.03,71.9 34.27,66.14 v33.81,66.14
BOOT_SCLK  (via drill 0.3)
  Top 0.3: v31.07,81.55 31.03,81.55 | RN15.1 45.2,63.8 v45.6,64.2
  Top 0.5: U$2.2 31.03,81.55 v31.07,81.55 | v33.7,67.55 34.2,67.55 IC2.6 37.55,64.2 v38.27,64.2
  Bottom 0.5: v33.7,67.55 31.07,70.17 v31.07,81.55 | v45.6,64.2 v38.27,64.2
FLASH_A_CS
  Top 0.3: IC3.C2 72.44,65.97 73.15,65.97 73.15,65.99 R17.2
FLASH_A_INT
  Top 0.3: R21.2 77.75,66.6 77.75,66.1 76.72,65.07 IC3.A5
FLASH_B_CS
  Top 0.3: R19.2 67.4,73.5 67.4,72.74 66.69,72.03 IC4.C2
FLASH_B_INT
  Top 0.3: R22.2 72.7,70.4 71.2,70.4 70.99,70.61 IC4.A5
FLASH_CS  (via drill 0.3)
  Top 0.4: v40.57,67.44 37.06,70.95 34.38,70.95 IC2.1 | R1.1
  Top 0.5: J11.4 41.91,75.41 41.91,72.72 R1.1 | R1.1 | v46.01,71.36 44.68,70.03 R1.1
  Bottom 0.5: v40.57,67.44 42.09,67.44 v46.01,71.36
GND  (via drill 0.3, 0.5, 1, 3.2)
  Top 0.3: 44.98,55.02 IC1.EPAD | IC1.1 42.71,56 43.4,56.69 | IC3.E5 71.82,61.11 71.07,61.11 68.64,58.68 67.5,58.68 v64.29,55.47 | C12.2 v59.88,59.88 | U1.4 U1.25 86.44,70.28 v86.75,70.6 | 68.81,71.32 69.31,70.82 69.74,70.82 73.35,74.43 v73.35,74.45 | 74.36,65.78 75.65,64.49 77.24,64.49 80.07,67.32 80.07,69.22 82.63,71.78 | U1.14 92.94,61.45 92.95,61.43 | U1.4 U1.5 U1.24 U1.23 | U1.4 U1.3 U1.2 U1.1 | IC4.B3 68.81,71.32 | 68.81,71.32 | v70.86,67.56 71.54,66.88 IC3.C1 | IC3.B3 74.36,65.78 | 74.36,65.78 | IC4.C1 65.34,72.67 v65.04,72.67
  Top 0.406: 17.99,79.21 17.99,79.22 | v59.88,59.88 60.36,60.36 61.1,60.36 62.72,61.98 62.72,64.18 66.32,67.78 IC4.E5
  Top 0.5: 32.52,67.43 32.52,65.55 38.22,59.85 v40.42,59.85 40.42,59.67 43.4,56.69 43.56,56.53 43.75,56.53 44.4,55.88 44.4,55.6 44.98,55.02 | 61.43,88.94 61.4,88.91 | 26.55,73.4 23.8,73.4 17.99,79.21 | v50.23,77.83 U$3.5 | U$2.6 23.26,83.11 21.87,83.11 17.99,79.22 11.93,73.17 J6.4 10.45,69.12 v3.8,69.12 3.8,61.93 J5.2 | U$2.6 | v61.43,13.6 70.98,23.16 C15.- | J12.9 30.86,7.34 v30.86,3.8 31.36,4.3 J7.2 | J7.20 61.93,3.8 v69.12,3.8 | IC5.1 IC5.2 IC5.3 31,31.69 v31,31 | 26.55,73.4 | 26.55,73.4 IC2.4 32.52,67.43 | 32.52,67.43 | R2.2 25.45,80.9 U$2.6
  Top 1: J7.20 J7.19 v61.43,13.6 | J7.2 J7.1 v38.57,13.6 | J5.19 J5.20 v1.94,38.57 | v98.06,38.57 J8.2 J8.1 v86.94,38.57 | v98.03,61.43 J8.20 92.95,61.43 J8.19 | J9.4 v58.89,98.06 | v61.43,98.06 J9.2 | v58.89,86.93 J9.3 | J9.3 J9.1 v61.43,86.94 | J9.2 J9.4 | J9.4 J9.3 | J9.2 61.43,88.94 | v58.88,83.42 v50.84,83.42 45.4,83.42 44.47,82.48 | 88.93,61.44 v86.94,61.44 | v1.94,61.43 J5.2 J5.1 v14.99,61.43 | J13.1 J13.4 J13.7 J13.10 J13.13 J13.16 J13.19 J13.22 | 44.47,82.48 v43.72,81.73 | v38.02,83.97 42.98,83.97 44.47,82.48
  Bottom 0.3: 59.86,59.86 v59.88,59.88 v64.29,55.47 | v73.35,74.45 76.31,77.41 J13.10
  Bottom 0.406: J13.22 83.81,70.6 v86.75,70.6
  Bottom 0.5: C4.2 40.42,59.58 v40.42,59.85 | 24.5,31 v31,31 | C2.2 | C2.2 v59.88,59.88 | C16.2 63.98,55.16 v64.29,55.47
  Bottom 0.8: v14.99,38.57 v14.99,38.58
  Bottom 1: J7.20 v61.43,1.4 | J7.1 v38.57,13.6 | J7.19 v61.43,13.6 | J5.20 v1.94,38.57 | v1.94,61.43 J5.2 | v58.88,83.42 v58.89,83.42 v58.89,86.93 J9.3 | v50.84,83.42 50.84,78.45 v50.23,77.83 | v23.08,29.59 23.08,30.49 v14.99,38.58 v14.99,61.43 J5.1 | C13.2 48.33,37.16 50,38.83 C5.2 47.71,40.05 46.13,41.63 44.51,41.63 43.4,40.52 42.14,40.52 C3.2 | J5.19 v14.99,38.57 | J9.1 v61.43,86.94 64.88,83.49 | J9.2 v61.43,98.06 | v58.89,98.06 J9.4 | J9.3 J9.1 | J9.2 J9.1 | J9.2 J9.4 | J9.4 J9.3 | J8.19 v86.94,61.44 85.44,61.44 83.89,59.89 83.89,39.89 85.21,38.57 v86.94,38.57 J8.1 | J8.20 v98.03,61.43 | v65.04,72.67 64.4,72.03 60.73,72.03 C19.2 | J8.2 95.7,31.36 v96.2,30.86
  other vias: 3.8,30.86 69.12,96.2 96.2,69.12 30.86,96.2 38.58,1.94 54,46 52,46 50,46 48,46 46,46 54,48 52,48 50,48 48,48 46,48 54,50 52,50 50,50 48,50 46,50 54,52 52,52 50,52 48,52 46,52 54,54 52,54 50,54 48,54 46,54 25,65 73,52 34,90 78.48,34.52 65.98,34.96 47.52,67.39 51.22,66.38 55.83,71.36 55.46,65.84 78.2,28.63
  pour Top (isolate 0.75): 100,29.32 70.7,0 29.3,0 0,29.3 0,70.7 29.3,100 70.7,100 100,70.7
  pour Bottom (isolate 0.75): 0.01,29.34 29.31,0.03 70.71,0.03 100.01,29.33 100.01,70.73 70.71,100.03 29.31,100.03 0.01,70.73
GPIO0  (via drill 0.5)
  Top 0.4: 77.21,39.87 74.28,42.8 RN9.1
  Top 0.5: 77.21,39.87 92.16,39.87 93.39,41.11
  Top 1: v98.06,41.11 J8.4 93.39,41.11
  Bottom 1: v98.06,41.11 J8.4
GPIO1  (via drill 0.5)
  Top 0.4: 77.35,41.11 74.86,43.6 RN9.2
  Top 0.5: 77.35,41.11 J8.3
  Top 1: v91.66,41.11 J8.3
  Bottom 1: v91.66,41.11 J8.3
GPIO2  (via drill 0.5)
  Top 0.4: 77.4,42.34 75.33,44.4 RN9.3
  Top 0.5: 77.4,42.34 92.1,42.34 93.42,43.65
  Top 1: v98.06,43.65 J8.6 93.42,43.65
  Bottom 1: v98.06,43.65 J8.6
GPIO3  (via drill 0.5)
  Top 0.4: 77.53,43.65 75.98,45.2 RN9.4
  Top 0.5: 77.53,43.65 J8.5
  Top 1: J8.5 v91.66,43.65
  Bottom 1: v91.66,43.65 J8.5
GPIO4  (via drill 0.5)
  Top 0.4: 77.88,44.92 76,46.8 RN10.1
  Top 0.5: 77.88,44.92 92.11,44.92 93.38,46.19
  Top 1: v98.06,46.19 J8.8 93.38,46.19
  Bottom 1: v98.06,46.19 J8.8
GPIO5  (via drill 0.5)
  Top 0.4: 77.9,46.19 76.49,47.6 RN10.2
  Top 0.5: 77.9,46.19 J8.7
  Top 1: J8.7 v91.66,46.19
  Bottom 1: v91.66,46.19 J8.7
GPIO6  (via drill 0.5)
  Top 0.4: 78.08,47.48 77.16,48.4 RN10.3
  Top 0.5: 78.08,47.48 92.13,47.48 93.39,48.73
  Top 1: v98.06,48.73 J8.10 93.39,48.73
  Bottom 1: v98.06,48.73 J8.10
GPIO7  (via drill 0.5)
  Top 0.4: 78.25,48.73 77.78,49.2 RN10.4
  Top 0.5: 78.25,48.73 J8.9
  Top 1: J8.9 v91.66,48.73
  Bottom 1: v91.66,48.73 J8.9
I2C0_PORT0
  Top 0.5: 25.9,34.99 21.82,34.99 19.13,32.3 19.13,29.3 15.85,26.02 15.51,25.68 | IC5.4 25.9,34.99 | 25.9,34.99 | J12.1 15.51,25.68 | 15.51,25.68
I2C0_PORT1
  Top 0.5: 25.11,33.99 22.68,33.99 20.44,31.75 20.44,27.62 J12.2 | IC5.5 25.11,33.99 | 25.11,33.99
I2C0_PORT2
  Top 0.3: 17.31,22.73 18.75,24.17
  Top 0.5: 24.32,32.98 23.37,32.98 21.61,31.23 21.61,27.04 18.75,24.17 | IC5.6 24.32,32.98 | 24.32,32.98 | J12.3 17.31,22.73 | 17.31,22.73
I2C0_PORT3
  Top 0.5: 25.71,29.8 25.71,29.31 J12.4 | IC5.7 25.71,29.8 | 25.71,29.8
I2C0_PORT4
  Top 0.3: 22.59,20.8 20.9,19.11 20.9,19.1
  Top 0.5: 29.34,24.37 26.16,24.37 22.59,20.8 | IC5.9 29.34,24.37 | 29.34,24.37 | J12.5 20.9,19.1 | 20.9,19.1
I2C0_PORT5
  Top 0.5: 30.05,25.46 25.46,25.46 J12.6 | IC5.10 30.05,25.46 | 30.05,25.46
I2C0_PORT6  (via drill 0.3)
  Top 0.3: v24.48,19.13 22.66,17.31
  Top 0.5: 32.75,24.56 32.75,23.82 29.99,21.05 v27.95,21.05 | IC5.11 32.75,24.56 | 32.75,24.56 | J12.7 22.66,17.31 | 22.66,17.31
  Bottom 0.8: v27.95,21.05 26.02,19.13 v24.48,19.13
I2C0_PORT7
  Top 0.5: 33.83,25.27 33.83,23.54 29.97,19.68 26.07,19.68 25.66,20.1 23.69,20.1 J12.8 | IC5.12 33.83,25.27 | 33.83,25.27
I2C_SCL0  (via drill 0.3, 0.5)
  Top 0.3: v36.41,26.29 | v39.87,26.29 39.87,26.11
  Top 0.5: RN3.1 42.8,34.24 39.87,31.31 v39.87,26.29 | 41.11,6.43 39.87,7.67 39.87,26.11 | IC5.14 v36.41,26.29
  Top 1: 41.11,6.43 J7.4 v41.11,1.94
  Bottom 0.3: v39.87,26.29
  Bottom 0.5: v39.87,26.29 v36.41,26.29 35.23,26.29 33,24.05 R5.1
  Bottom 1: J7.4 v41.11,1.94
I2C_SCL1  (via drill 0.3, 0.5)
  Top 0.3: U1.26 85.78,67.39 83.9,65.5 83.9,64.1 v83.7,63.9
  Top 0.5: RN3.3 44.4,33 42.4,31 v42.4,24.25 42.4,7.7 43.65,6.45
  Top 1: v43.65,1.94 J7.6 43.65,6.45
  Bottom 0.3: v83.7,63.9 79.5,59.7 79.5,20.95 78.7,20.15 68,20.15 64.1,24.05 56.8,24.05 56.6,24.25 v42.4,24.25
  Bottom 0.5: R7.1 37,23.6 37.65,24.25 v42.4,24.25
  Bottom 1: J7.6 v43.65,1.94
I2C_SCL2  (via drill 0.3, 0.5)
  Top 0.4: RN4.1 46.8,29.32 44.93,27.45
  Top 0.5: 44.93,27.45 v44.93,20.22 44.93,7.78 46.19,6.52
  Top 1: 46.19,6.52 J7.8 v46.19,1.94
  Bottom 0.5: v44.93,20.22 41.02,20.22 40.85,20.05 33.75,20.05 32,18.3 R9.1
  Bottom 1: J7.8 v46.19,1.94
I2C_SCL3  (via drill 0.3, 0.5)
  Top 0.4: RN4.3 48.4,28.16 47.44,27.2
  Top 0.5: 47.44,27.2 v47.44,17.93 47.44,7.82 48.73,6.53
  Top 1: 48.73,6.53 J7.10 v48.73,1.94
  Bottom 0.5: v47.44,17.93 36.31,17.93 36,17.61 R11.1
  Bottom 1: J7.10 v48.73,1.94
I2C_SDA0  (via drill 0.3, 0.5)
  Top 0.406: v36.99,27.5
  Top 0.5: J7.3 v41.11,25.29 v41.11,27.5 41.11,31.11 43.6,33.6 RN3.2 | IC5.15 v36.99,27.5 | v36.99,27.5
  Top 1: v41.11,8.34 J7.3
  Bottom 0.5: v41.11,25.29 36.59,25.29 35,23.7 R6.1
  Bottom 0.8: v36.99,27.5 v41.11,27.5
  Bottom 1: J7.3 v41.11,8.34
I2C_SDA1  (via drill 0.3, 0.5)
  Top 0.3: U1.27 85.14,67.73 83,65.6 83,63.3 83.2,63.1 v83.2,62
  Top 0.5: J7.5 v43.65,23.02 43.65,30.89 45.2,32.44 RN3.4
  Top 1: v43.65,8.34 J7.5
  Bottom 0.3: v43.65,23.02 63.84,23.02 67.45,19.41 79.23,19.41 80.29,20.47 80.29,59.09 v83.2,62
  Bottom 0.5: v43.65,23.02 39.17,23.02 R8.1
  Bottom 1: J7.5 v43.65,8.34
I2C_SDA2  (via drill 0.3, 0.5)
  Top 0.4: RN4.2 47.6,28.74 46.19,27.33
  Top 0.5: 46.19,27.33 v46.19,19.09 J7.7
  Top 1: J7.7 v46.19,8.34
  Bottom 0.5: v46.19,19.09 34.89,19.09 34,18.2 R10.1
  Bottom 1: J7.7 v46.19,8.34
I2C_SDA3  (via drill 0.3, 0.5)
  Top 0.4: RN4.4 49.2,27.52 48.73,27.05
  Top 0.5: 48.73,27.05 v48.73,16.84 J7.9
  Top 1: v48.73,8.34 J7.9
  Bottom 0.5: R12.1 v48.72,16.85 v48.73,16.84
  Bottom 1: J7.9 v48.73,8.34
N$7
  Top 0.5: J11.7 33.6,74.32 32.02,74.32 R2.1
N$8  (via drill 0.3)
  Top 0.3: v32.66,76.81
  Top 0.5: R3.1 v32.66,76.81
  Bottom 0.3: v32.66,76.81 33.97,78.12 35.6,78.12 J11.5
N$10
  Top 0.5: U$2.7 | U$2.7 25.82,78.98 25.82,78.2 R4.2
P0
  Top 0.3: IC1.3 41.48,55 41.2,55.28 41.2,56.95 39.95,58.2 RN1.8
P1
  Top 0.3: IC1.4 41.26,54.5 40.65,55.12 40.65,56.62 39.86,57.4 RN1.7
P2
  Top 0.3: IC1.6 41.51,53.5 40.05,54.97 40.05,56.15 39.59,56.6 RN1.6
P3
  Top 0.3: IC1.7 41.27,53 39.45,54.83 39.45,55.48 39.12,55.8 RN1.5
P4
  Top 0.3: IC1.9 41.3,52 39.6,53.7 RN2.8
P5
  Top 0.3: IC1.10 41.07,51.5 39.67,52.9 RN2.7
P6
  Top 0.3: IC1.12 39.95,50.5 38.35,52.1 RN2.6
P7
  Top 0.3: IC1.13 39.42,50 38.12,51.3 RN2.5
P8
  Top 0.3: IC1.15 41.17,49 40.97,49.2 RN7.8
P9
  Top 0.3: IC1.16 41.22,48.5 41.12,48.4 RN7.7
P10
  Top 0.3: IC1.18 41.16,47.5 41.06,47.6 RN7.6
P11
  Top 0.3: IC1.19 41.18,47 40.98,46.8 RN7.5
P12
  Top 0.3: IC1.21 39.4,46 38.6,45.2 RN8.8
P13
  Top 0.3: IC1.22 39.8,45.5 38.7,44.4 RN8.7
P14
  Top 0.3: IC1.24 39.8,44.5 38.9,43.6 RN8.6
P15
  Top 0.3: IC1.25 40.2,44 39,42.8 RN8.5
P16
  Top 0.3: IC1.27 44.5,41.48 42.8,39.77 RN3.8
P17
  Top 0.3: IC1.28 45,41.18 43.6,39.78 RN3.7
P18
  Top 0.3: IC1.30 46,39.98 45.46,39.45 44.77,39.45 44.4,39.08 RN3.6
P19
  Top 0.3: IC1.31 46.5,39.75 45.38,38.62 RN3.5
P20
  Top 0.3: IC1.33 47.5,39.9 46.8,39.2 RN4.8
P21
  Top 0.3: IC1.34 48,39.6 47.6,39.2 RN4.7
P22
  Top 0.3: RN4.6 48.4,39.25 49,39.85 IC1.36
P23
  Top 0.3: IC1.37 49.5,39.5 49.2,39.2 RN4.5
P24
  Top 0.3: IC1.39 50.5,39.62 50.55,39.57 RN5.8
P25
  Top 0.3: IC1.40 51,39.9 51.35,39.55 RN5.7
P26
  Top 0.3: IC1.42 52,39.84 52.15,39.7 RN5.6
P27
  Top 0.3: IC1.43 52.5,40.12 52.95,39.67 RN5.5
P28
  Top 0.3: IC1.45 53.5,40.19 54.3,39.38 RN6.8
P29
  Top 0.3: IC1.46 54,40.55 55.1,39.45 RN6.7
P30
  Top 0.3: IC1.48 55,40.73 55.9,39.83 RN6.6
P31
  Top 0.3: IC1.49 55.5,41.02 56.7,39.81 RN6.5
P32
  Top 0.3: RN9.8 61.15,42.8 58.95,45 IC1.53
P33
  Top 0.3: RN9.7 61.3,43.6 59.4,45.5 IC1.54
P34
  Top 0.3: RN9.6 61.5,44.4 59.4,46.5 IC1.56
P35
  Top 0.3: RN9.5 61.65,45.2 59.85,47 IC1.57
P36
  Top 0.3: RN10.8 61.05,46.8 59.85,48 IC1.59
P37
  Top 0.3: RN10.7 61.25,47.6 60.35,48.5 IC1.60
P38
  Top 0.3: RN10.6 61.45,48.4 60.35,49.5 IC1.62
P39
  Top 0.3: RN10.5 61.6,49.2 60.8,50 IC1.63
P40  (via drill 0.3)
  Top 0.3: v71.47,59.49 62.98,51 IC1.65 | v63.32,67.49 63.56,67.49 65.97,69.9 IC4.D3 | IC3.D3 71.54,64.36 70.98,63.8 70.98,63.78 v69.08,61.88
  Bottom 0.3: v71.47,59.49 v69.08,61.88 63.47,67.49 v63.32,67.49
P41  (via drill 0.3)
  Top 0.2: 70.14,64.38 70.83,65.07 IC3.D2 | 66.6,62.57 66.45,62.57 65.57,61.69 v65.57,61.46
  Top 0.3: IC4.D2 65.27,70.61 63.49,68.83 62.72,68.83 v60.49,66.6 | IC1.66 62.61,51.5 68.74,57.63 v68.74,57.91 | 70.14,64.38 68.41,64.38 66.6,62.57
  Bottom 0.3: v60.49,66.6 60.49,66.54 v65.57,61.46 68.74,58.29 v68.74,57.91
P42  (via drill 0.3)
  Top 0.2: 73.85,64.17 73.85,63.5 74.25,63.1
  Top 0.3: 74.25,63.1 74.25,61.27 v68.94,55.96 | v67.44,57.46 62.48,52.5 IC1.68 | v69.03,66.78 68.92,66.78 68.92,66.77 66.7,64.55 66.7,63.53 65.65,62.48 65.45,62.48 64.84,61.87 64.84,60.78 v64.48,60.42 | IC4.C4 68.29,69.72 69,69.72 v70.19,68.53 | IC3.C4 | IC3.C4 73.85,64.17
  Bottom 0.2: v67.44,57.46
  Bottom 0.3: v68.94,55.96 v67.44,57.46 64.48,60.41 v64.48,60.42 | v69.03,66.78 70.19,67.93 v70.19,68.53
P43  (via drill 0.3)
  Top 0.2: IC4.D4 67.38,69.22 66.71,69.22
  Top 0.3: 66.71,69.22 v61.7,64.21 | IC1.69 60.23,53 v66.58,59.35 68.4,59.35 71.33,62.28 71.33,62.75 72.24,63.66 IC3.D4
  Bottom 0.2: 61.76,64.21 v61.7,64.21
  Bottom 0.3: v66.58,59.35 61.72,64.21 v61.7,64.21
P44  (via drill 0.3)
  Top 0.3: IC1.71 59.91,54 67.38,61.47 67.38,62.25 v68.74,63.61 | v66.09,66.25 66.98,67.14 67.6,67.14 68.11,67.65 IC4.D5 | v71.97,60.38 73.66,62.07 IC3.D5
  Bottom 0.2: v66.09,66.25 v66.1,66.25
  Bottom 0.3: v71.97,60.38 v68.74,63.61 v66.1,66.25
P45  (via drill 0.3)
  Top 0.2: IC3.E3 70.07,62.19 70.07,61.84 68.56,60.33 v68.17,60.33
  Top 0.3: IC4.E3 62.79,66 v62.46,66 | v66.69,61.81 66.69,61.55 59.64,54.5 IC1.72
  Bottom 0.2: 62.5,66 v62.46,66
  Bottom 0.3: v68.17,60.33 v66.69,61.81 62.5,66
P46  (via drill 0.3)
  Top 0.3: IC3.E2 69.1,62.63 68.76,62.63 68.39,62.26 68.39,61.92 v68.1,61.63 | IC1.74 58.6,55.5 64.32,61.22 64.32,62.15 v65.94,63.77 | IC4.E2 63.61,68.23 63.1,68.23 v62.28,67.41
  Bottom 0.2: v68.09,61.63 v68.1,61.63 | v65.94,63.77
  Bottom 0.3: v65.94,63.77 v68.09,61.63 | v65.94,63.77 62.3,67.41 v62.28,67.41
P47  (via drill 0.3)
  Top 0.2: IC3.E1 68.52,65.07 v68.4,65.19 | 67.33,66.25 v67.33,66.27
  Top 0.3: IC1.75 58.31,56 63.71,61.4 63.71,62.64 67.33,66.25 | IC4.E1 64.31,70.61 v63.63,69.93
  Bottom 0.2: 63.66,69.93 v63.63,69.93
  Bottom 0.3: v68.4,65.19 v67.33,66.27 63.66,69.93
P48  (via drill 0.3)
  Top 0.3: IC1.77 55.5,58.49 55.65,58.64 56.74,58.64 59.41,61.31 v60.45,61.31 | v68.44,53.31 76.37,61.24 v76.37,63.77 | IC3.B2 v72.95,68.06
  Bottom 0.2: v60.45,61.3 v60.45,61.31
  Bottom 0.3: v68.44,53.31 v60.45,61.3 | v72.95,68.06 72.95,67.19 v76.37,63.77
P49  (via drill 0.3)
  Top 0.3: IC1.78 55,58.63 55.52,59.16 56.33,59.16 59.87,62.7 59.87,65.72 59.59,66 59.59,68.16 64.76,73.33 65.58,73.33 v67.36,75.11 v67.37,75.11 | IC4.B2 68.09,72.02 68.96,72.89 v68.96,73.52
  Bottom 0.3: v68.96,73.52 v67.37,75.11
P50  (via drill 0.3)
  Top 0.2: 74.89,63.85 73.88,64.86 73.16,64.86 IC3.C3
  Top 0.3: IC1.80 54,59.2 55.35,60.55 56.26,60.55 58.71,63 v59.02,63 | v68.77,54.75 74.89,60.87 74.89,63.85
  Bottom 0.3: v68.77,54.75 60.52,63 v59.02,63
P51  (via drill 0.3)
  Top 0.2: IC4.C3 67.64,70.37 68.27,70.37 68.5,70.14 69.1,70.14 69.33,70.37 69.76,70.37 v71.17,68.96
  Top 0.3: IC1.81 53.5,59.56 57.92,63.98 57.92,67.46 64.85,74.39 v65.12,74.39
  Bottom 0.3: v65.12,74.39 65.74,74.39 v71.17,68.96
P52  (via drill 0.3)
  Top 0.3: IC1.83 52.5,59.47 57.3,64.27 57.3,67.81 64.85,75.36 v65.99,75.36 | 77.08,70.1 arc-90 R17.1 | R17.1 R18.1 | v72.89,69.25 74.02,70.38 76.52,70.38 R17.1
  Bottom 0.3: v65.99,75.36 72.1,69.25 v72.89,69.25
P53
  Top 0.2: 52.9,60.65 56.58,64.33
  Top 0.3: 52.9,60.65 52,59.75 IC1.84 | 56.58,64.33 56.58,68.05 64.67,76.14 67.96,76.14 68.49,76.67 69.89,76.67 R19.1 R20.1
P54
  Top 0.3: R21.1 79.35,68.2 79.35,69.8 75.67,73.47 | IC1.86 51,63.3 65.5,77.8 71.35,77.8 75.67,73.47 | R22.1 75.67,73.38 75.67,73.47
P55  (via drill 0.3)
  Top 0.3: IC1.87 50.5,63.65 63,76.15 v63,77 | IC4.A4 69.52,71.62 v70.67,72.78 | IC3.A4 76.32,65.78 v76.89,66.35
  Bottom 0.3: v76.89,66.36 v76.89,66.35 76.89,66.56 v70.67,72.78 66.53,76.92 63.08,76.92 v63,77
P56
  Top 0.3: IC1.89 49.5,60.42 49.7,60.62 RN16.8
P57
  Top 0.3: IC1.90 49,60.46 48.9,60.56 RN16.7
P58
  Top 0.3: IC1.92 48,59.83 48.1,59.93 RN16.6
P59
  Top 0.3: IC1.93 47.5,59.81 47.3,60.02 RN16.5
P60
  Top 0.3: IC1.95 46.5,59.5 45.2,60.8 RN15.8
P61
  Top 0.3: IC1.96 46,59.15 44.4,60.75 RN15.7
P62
  Top 0.3: IC1.98 45,59.35 43.6,60.75 RN15.6
P63
  Top 0.3: IC1.99 44.5,59.05 42.8,60.75 RN15.5
PWM0  (via drill 0.3, 0.5)
  Top 0.3: 86.71,50.03 84.52,50.03 79.6,54.95 v79.6,62.05 | U1.6 87.73,64.58 v87.8,64.64
  Top 0.5: 93.38,51.27 92.14,50.03 86.71,50.03
  Top 1: 93.38,51.27 J8.12 v98.06,51.27
  Bottom 0.3: v79.6,62.05 82.19,64.64 v87.8,64.64
  Bottom 1: v98.06,51.27 J8.12
PWM1  (via drill 0.3, 0.5)
  Top 0.3: U1.7 88.39,64.22 88.65,64.48 v88.65,65.4 | v80,64 80.4,63.6 80.4,55.2 84.33,51.27 86.8,51.27
  Top 0.5: J8.11 86.8,51.27
  Top 1: J8.11 v91.66,51.27
  Bottom 0.3: v88.65,65.4 81.4,65.4 v80,64
  Bottom 1: v91.66,51.27 J8.11
PWM2  (via drill 0.3, 0.5)
  Top 0.3: v89.5,66.4 89.5,64.6 89.03,64.14 U1.8 | v80.45,66.4 81.15,65.7 81.15,55.63 84.23,52.55 86.72,52.55
  Top 0.5: 93.4,53.81 92.14,52.55 86.72,52.55
  Top 1: v98.06,53.8 v98.05,53.81 J8.14 93.4,53.81
  Bottom 0.3: v80.45,66.4 v89.5,66.4
  Bottom 1: J8.14 v98.06,53.8
PWM3  (via drill 0.3, 0.5)
  Top 0.3: v90.2,67.2 90.2,64.45 89.69,63.94 U1.9 | v81.1,67.3 81.8,66.6 81.8,56.04 84.03,53.81 86.73,53.81
  Top 0.5: J8.13 86.73,53.81 86.65,53.81
  Top 1: J8.13 v91.66,53.81
  Bottom 0.3: v81.1,67.3 90.1,67.3 v90.2,67.2
  Bottom 1: v91.66,53.81 J8.13
PWM4  (via drill 0.3, 0.5)
  Top 0.3: v91.1,67.75 91.1,66.3 90.75,65.95 90.75,64.25 90.33,63.84 U1.10 | v81.7,68.25 82.45,67.5 82.45,56.65 84.03,55.08 86.67,55.08
  Top 0.5: 93.44,56.35 92.17,55.08 86.67,55.08
  Top 1: 93.44,56.35 J8.16 v98.06,56.35
  Bottom 0.3: v81.7,68.25 90.6,68.25 v91.1,67.75
  Bottom 1: v98.06,56.35 J8.16
PWM5  (via drill 0.5)
  Top 0.3: 86.61,56.35 85.25,57.71 85.25,61.55 86.05,62.35 90.75,62.35 90.98,62.59 U1.11
  Top 0.5: J8.15 86.61,56.35
  Top 1: J8.15 v91.66,56.35
  Bottom 1: v91.66,56.35 J8.15
PWM6  (via drill 0.3, 0.5)
  Top 0.3: U1.12 91.64,64.06 91.5,64.2 v91.5,65.45
  Top 1: J8.18 v98.06,58.89
  Bottom 0.3: v91.5,65.45 92.95,65.45 93.25,65.15 93.25,59.15 93.51,58.89 v98.06,58.89
  Bottom 1: v98.06,58.89 J8.18
PWM7  (via drill 0.3, 0.5)
  Top 0.3: U1.13 92.28,64.62 v92.3,64.64
  Top 1: J8.17 v91.66,58.89
  Bottom 0.3: v91.66,58.89 92.3,59.53 v92.3,64.64
  Bottom 1: v91.66,58.89 J8.17
PWM8
  Top 0.3: U1.15 92.94,76.56 79.35,90.15 77.58,90.15 J13.3
PWM9
  Top 0.3: U1.16 92.28,76.27 80.5,88.05 79.07,88.05 J13.6
PWM10
  Top 0.3: U1.17 91.64,75.86 81.55,85.95 80.56,85.95 J13.9
PWM11
  Top 0.3: U1.18 90.98,75.47 82.55,83.9 82.1,83.9 J13.12
PWM12
  Top 0.3: U1.19 90.33,75.11 83.95,81.5 83.3,81.5 J13.15
PWM13
  Top 0.3: U1.20 89.69,74.72 85.35,79.05 84.44,79.05 J13.18
PWM14
  Top 0.3: U1.21 89.03,74.42 86.45,77 85.98,77 J13.21
PWM15
  Top 0.3: U1.22 88.39,73.21 J13.24
RAM_A_CS
  Top 0.3: R18.2 76.48,67.18 75.53,67.18 74.83,66.48 IC3.A3
RAM_B_CS
  Top 0.3: IC4.A3 70.31,73.52 R20.2
RESET_N  (via drill 0.3, 0.5)
  Top 0.3: IC1.100 44,58.72 40.75,61.97 40.75,63.95 41.42,64.62 41.42,67.81
  Top 0.4: 41.42,67.81 v39.91,69.33
  Top 0.5: J6.3 23.9,62.23 v23.95,62.23
  Top 1: J9.17 v41.11,86.94 v41.1,86.94
  Bottom 0.5: 41.89,71.31 v39.91,69.33 32.81,62.23 v23.95,62.23
  Bottom 1: J9.17 v41.1,86.94 41.1,86.4 41.89,85.61 | 41.89,85.61 | 41.89,71.31 | 41.89,85.61 J11.2 | 41.89,71.31 J11.2 | J11.2 R16.1
RTC_SCL
  Top 0.4: RN16.1 49.7,66.97 50.23,67.5
  Top 0.5: 50.23,67.5 R13.1 U$3.8
RTC_SDA
  Top 0.4: RN16.2 48.9,70.22 48.16,70.97 R14.1
  Top 0.5: U$3.7 48.42,74.29 R14.1
RXD  (via drill 0.3, 0.5)
  Top 0.3: RN15.4 v41.55,62.62
  Top 0.5: J6.2 19.7,70.02 24.5,70.02 35.06,59.46 v35.41,59.46
  Top 1: J9.20 v38.57,98.06
  Bottom 0.5: v41.55,62.62 39.48,62.62 36.31,59.46 v35.41,59.46 | 32.06,92.67 15.52,76.13 J6.2
  Bottom 1: v38.57,98.06 J9.20 38.57,93.72 37.51,92.67 32.06,92.67
SD_CLK  (via drill 0.3, 0.5)
  Top 0.3: v27.95,79.97 v27.95,79.96 | J11.3 38.3,77.2 40.65,74.85 v40.65,74.25 | 33.83,83.49 v33.83,83.54 | v38.48,72.08 44.4,66.15 RN15.2
  Top 0.5: J11.3 33.83,83.49 | U$2.5 v27.95,79.97 v27.95,79.96
  Bottom 0.5: v27.95,79.96 31.53,83.54 v33.83,83.54 | v38.48,72.08 v40.65,74.25
SPI_MISO0  (via drill 0.5)
  Top 0.4: RN1.3 30.89,56.6 29.89,57.6
  Top 0.5: 29.89,57.6 7.54,57.6 6.29,56.35
  Top 1: 6.29,56.35 J5.6 v1.94,56.35
  Bottom 1: v1.94,56.35 J5.6
SPI_MISO1  (via drill 0.5)
  Top 0.4: RN2.3 29.59,52.1 29.2,52.48
  Top 0.5: 29.2,52.48 7.51,52.48 6.29,51.27
  Top 1: 6.29,51.27 J5.10 v1.94,51.27
  Bottom 1: v1.94,51.27 J5.10
SPI_MISO2  (via drill 0.5)
  Top 0.4: RN7.3 28.25,47.6 28.09,47.43
  Top 0.5: 28.09,47.43 7.74,47.43 6.5,46.19
  Top 1: 6.5,46.19 J5.14 v1.94,46.19
  Bottom 1: v1.94,46.19 J5.14
SPI_MISO3  (via drill 0.5)
  Top 0.4: RN8.3 29.34,43.6 28.09,42.36
  Top 0.5: 28.09,42.36 7.71,42.36 6.46,41.11
  Top 1: 6.46,41.11 J5.18 v1.94,41.11
  Bottom 1: J5.18 v1.94,41.11
SPI_MOSI0  (via drill 0.5)
  Top 0.4: RN1.2 31.79,57.4 30.3,58.89
  Top 0.5: 30.3,58.89 J5.3
  Top 1: J5.3 v8.34,58.89
  Bottom 1: v8.34,58.89 J5.3
SPI_MOSI1  (via drill 0.5)
  Top 0.4: RN2.2 30.05,52.9 29.14,53.81
  Top 0.5: 29.14,53.81 J5.7
  Top 1: J5.7 v8.34,53.81
  Bottom 1: v8.34,53.81 J5.7
SPI_MOSI2  (via drill 0.5)
  Top 0.4: RN7.2 28.27,48.4 27.93,48.73
  Top 0.5: 27.93,48.73 J5.11
  Top 1: J5.11 v8.34,48.73
  Bottom 1: v8.34,48.73 J5.11
SPI_MOSI3  (via drill 0.5)
  Top 0.4: RN8.2 28.84,44.4 28.09,43.65
  Top 0.5: 28.09,43.65 J5.15
  Top 1: J5.15 v8.34,43.65
  Bottom 1: v8.34,43.65 J5.15
SPI_SCLK0  (via drill 0.5)
  Top 0.4: RN1.1 32.53,58.2 30.57,60.16
  Top 0.5: 30.57,60.16 7.65,60.16 6.38,58.89
  Top 1: 6.38,58.89 J5.4 v1.94,58.89
  Bottom 1: v1.94,58.89 J5.4
SPI_SCLK1  (via drill 0.5)
  Top 0.4: RN2.1 30.42,53.7 29.05,55.06
  Top 0.5: 29.05,55.06 7.49,55.06 6.23,53.81
  Top 1: 6.23,53.81 J5.8 v1.94,53.81
  Bottom 1: J5.8 v1.94,53.81
SPI_SCLK2  (via drill 0.5)
  Top 0.4: RN7.1 28.45,49.2 27.72,49.92
  Top 0.5: 27.72,49.92 7.64,49.92 6.45,48.73
  Top 1: 6.45,48.73 J5.12 v1.94,48.73
  Bottom 1: J5.12 v1.94,48.73
SPI_SCLK3  (via drill 0.5)
  Top 0.4: RN8.1 28.28,45.2 27.98,44.9
  Top 0.5: 27.98,44.9 7.64,44.9 6.39,43.65
  Top 1: 6.39,43.65 J5.16 v1.94,43.65
  Bottom 1: v1.94,43.65 J5.16
SPI_SS0  (via drill 0.5)
  Top 0.4: RN1.4 30.02,55.8 29.47,56.35
  Top 0.5: 29.47,56.35 J5.5
  Top 1: J5.5 v8.34,56.35
  Bottom 1: J5.5 v8.34,56.35
SPI_SS1  (via drill 0.5)
  Top 0.4: RN2.4 27.75,51.3 27.71,51.27
  Top 0.5: 27.71,51.27 J5.9
  Top 1: J5.9 v8.34,51.27
  Bottom 1: J5.9 v8.34,51.27
SPI_SS2  (via drill 0.5)
  Top 0.4: RN7.4 28.55,46.8 27.94,46.19
  Top 0.5: 27.94,46.19 J5.13
  Top 1: J5.13 v8.34,46.19
  Bottom 1: J5.13 v8.34,46.19
SPI_SS3  (via drill 0.5)
  Top 0.4: RN8.4 29.84,42.8 28.14,41.11
  Top 0.5: 28.14,41.11 J5.17
  Top 1: J5.17 v8.34,41.11
  Bottom 1: J5.17 v8.34,41.11
TXD  (via drill 0.3, 0.5)
  Top 0.3: RN15.3 43.6,63.15 43.31,63.44 v42.23,63.44
  Top 0.5: v35.73,60.52 24.66,71.6 21.71,71.6 J6.1
  Top 1: 38.57,90.06 J9.19 v38.57,86.94
  Bottom 0.5: v42.23,63.44 38.65,63.44 v35.73,60.52
  Bottom 1: J6.1 21.12,76 31.52,86.4 38.03,86.4 v38.57,86.94 J9.19
U_1V8  (via drill 0.3, 0.5)
  Top 0.3: 56.52,50.5 v56.65,50.5 IC1.64 | IC1.2 v43.35,55.5 | v53,56.66 v52.99,56.65 IC1.82 | IC1.94 v47,56.65 | v50,56.65 IC1.88 | v53,43.35 IC1.44 | v47,43.35 IC1.32 | v44,43.35 IC1.26 | v43.35,52.5 IC1.8 | v43.35,46.5 IC1.20 | IC1.76 v56,56.65 | IC1.70 v56.65,53.5 | IC1.52 v56.65,44.5 | IC1.58 v56.65,47.5 | IC1.38 v50,43.35 | IC1.14 v43.35,49.5
  Top 1: J9.7 v53.81,86.95 v53.8,86.94 | J9.7 J9.8 | J9.5 J9.6 | J9.6 v56.35,98.07 | v53.81,98.06 J9.8 | J9.8 J9.6 | J9.5 J9.7 | v56.35,86.94 J9.5
  Bottom 0.3: 56.65,56.65
  Bottom 0.4: 53.81,56.65 v52.99,56.65
  Bottom 1: v56.65,50.5 v56.65,47.5 v56.65,44.5 56.65,43.35 | v56.65,50.5 v56.65,53.5 56.65,56.65 | v50,43.35 v53,43.35 56.65,43.35 | v50,43.35 v47,43.35 v44,43.35 43.35,43.35 | v52.99,56.65 v56,56.65 56.65,56.65 | v50,56.65 v52.99,56.65 | v50,56.65 v47,56.65 43.35,56.65 | v43.35,49.5 v43.35,52.5 v43.35,55.5 43.35,56.65 | v43.35,49.5 v43.35,46.5 43.35,43.35 | J9.8 v53.81,98.06 | C1.1 56.65,43.35 | C5.1 v50,43.35 | C6.1 v43.35,49.5 | C7.1 v50,56.65 | C8.1 v56.65,50.5 | C3.1 43.35,43.35 | C4.1 43.35,56.65 | v52.99,56.65 52.99,69.23 53.8,70.03 J9.7 | v56.35,98.07 J9.6 | J9.6 J9.8 | J9.8 J9.7 | J9.5 J9.7 | J9.6 v56.35,86.94 | 56.65,56.65 | 56.65,56.65 C2.1
U_3V3  (via drill 0.3, 0.5)
  Top 0.2: 72.95,62.95 73.43,63.43 73.43,63.88 | 72.19,65.12 72.3,65.12 72.7,65.53 73.16,65.53 73.42,65.27 74.16,65.27 IC3.B4 | 71.18,66.13 | 66.69,70.62
  Top 0.25: 66.69,70.62 67.16,71.08 67.64,71.08 67.92,70.81
  Top 0.3: IC1.67 55.85,52 | 55.85,55 IC1.73 59.16,55 v59.32,55.16 | IC1.85 51.5,55.85 | IC1.97 45.5,55.85 | IC1.55 55.85,46 | 55.85,49 IC1.61 | 51.5,44.15 IC1.41 | IC1.35 48.5,44.15 | 44.15,48 IC1.17 | IC1.23 44.15,45 | IC1.5 44.15,54 | v40.3,51.25 40.55,51 IC1.11 44.15,51 | 43.02,43.41 43.75,44.15 44.15,44.15 | 56.77,56.77 56.77,56.38 56.24,55.85 | v45.14,40.28 45.5,40.64 IC1.29 45.5,44.15 | 23.82,77.99 23.82,78 | 54.5,55.85 IC1.79 54.5,58.94 55.44,59.87 v55.87,59.87 | IC1.47 54.5,44.15 | IC1.91 48.5,55.85 | 73.43,63.88 72.19,65.12 71.18,66.13 68.11,69.19 | 68.11,69.19 66.69,70.62 | IC3.D1 71.18,66.13 | 67.92,70.81 68.62,70.81 IC4.B4 | IC4.E4 67.41,68.49 68.11,69.19 | v60.62,68.09 63.85,71.32 IC4.D1 66,71.32 66.69,70.62 | 72.95,62.95 IC3.E4 | IC3.E4 | v72.1,62.4 72.1,62.81 IC3.E4
  Top 0.4: v47.16,70.02
  Top 0.5: 55.85,55.85 55.85,55 55.85,52 55.85,49 55.85,46 55.85,44.15 54.5,44.15 51.5,44.15 48.5,44.15 45.5,44.15 44.15,44.15 44.15,45 44.15,48 44.15,51 44.15,54 | 55.85,55.85 54.5,55.85 51.5,55.85 48.5,55.85 45.5,55.85 | IC2.7 IC2.8 38.8,66.54 v38.8,66.17 | C12.1 56.77,56.77 | 56.24,55.85 55.85,55.85 | 23.82,77.99 24.11,77.99 25.69,76.42 25.69,76.06 IC2.3 33.16,68.59 34.95,68.59 IC2.7 | 23.82,78 v21.53,80.3 | v35.11,32.47 35.11,31.18 IC5.16 | 38.04,28.25 38.04,26.25 v31.84,20.04 v31.84,20.05 | R14.2 46.41,74.51 46.41,72.61 47.16,71.86 v47.16,70.02 R1.2 | U$3.2 52.94,74.29 | 52.94,74.29 52.94,79 | 52.94,74.29 52.94,73.53 51.92,72.52 R13.2 | v48.73,86.94 v48.72,86.94 | v25.39,84.15 25.39,84.08 U$2.4 R3.2 | IC5.16 | IC5.16 38.04,28.25 | 38.04,28.25 | IC2.7 | C11.1 42.17,42.57 43.02,43.41
  Top 0.6: C9.1 55.85,44.12 55.85,44.15
  Top 1: v57.82,79 52.94,79 v48.73,79 | J9.10 J9.9 J9.11 | v48.72,86.94 J9.11 | J9.10 v51.27,98.06 v51.26,98.06 | J9.12 v48.73,98.07 | J9.10 J9.12 | J9.12 J9.11
  Bottom 0.3: C16.1 v59.32,55.16 | v40.3,51.25 39.55,51.25 C10.1 | v45.14,40.28 v45.15,40.27 | v48.73,79.01 48.73,79.17
  Bottom 0.4: v60.62,68.09 59.55,68.09 57.81,68.09
  Bottom 0.406: C18.1 v72.1,62.4 | C19.1 59.55,68.09
  Bottom 0.5: v45.15,40.27 C13.1 | v25.39,84.15 v21.54,80.3 v21.53,80.3 | R5.2 32.94,21.15 | v31.84,20.04 v31.84,20.05
  Bottom 0.8: v35.11,32.47 41.7,39.05 C13.1 | v55.87,59.87 C14.1 | R8.2 R7.2 R6.2 R5.2 | R12.2 R11.2 R10.2 R9.2 | 32.94,21.15 v31.84,20.05
  Bottom 1: C10.1 39.19,54.61 37.61,56.19 34.98,56.19 33.06,58.11 33.06,60.73 38.5,66.17 v38.8,66.17 43.31,66.17 v47.16,70.02 48.73,71.58 v48.73,79 v48.73,79.01 | R9.2 28.2,15.15 | v31.84,20.04 28.2,16.41 28.2,15.15 | J9.9 v51.27,86.94 | J9.9 | J9.10 v51.26,98.06 | J9.12 v48.73,98.07 | J9.11 J9.9 | J9.9 J9.10 | J9.10 J9.12 | J9.12 J9.11 | J9.11 v48.73,79.01 | v57.81,79 57.81,68.09 57.81,60.98 C14.1 | 28.2,15.15 26.65,15.15 J12.10 | v48.73,79.01 R16.2
  Bottom 1.016: D1.A 72.61,41.76 60.66,53.7 C16.1
U_5V  (via drill 0.3, 0.5)
  Top 0.3: 84.48,69.89 U1.28
  Top 0.406: C17.1 94.65,65.45 v93.6,66.5
  Top 0.5: 84.48,69.89 85.29,70.69 J13.23
  Top 1: J9.15 v43.65,86.94 | J9.16 J9.14 | v43.66,98.06 J9.16 | J9.16 J9.15 | v46.19,98.07 J9.13 | J9.13 v46.19,86.94 47.98,85.15 63.55,85.15 65.35,86.95 71.05,86.95 J13.2 | J9.13 J9.15 | J13.23 J13.20 J13.17 J13.14 J13.11 J13.8 J13.5 J13.2 | J13.2
  Bottom 0.406: v93.6,66.5 92.2,67.9 92.2,68.98 88.47,72.71 J13.23
  Bottom 1: J9.13 v46.19,86.94 | J9.14 J9.13 | J9.16 J9.15 | v46.19,98.07 J9.14 | J9.14 J9.16 v43.66,98.06 | J9.13 J9.15 | J9.15 v43.65,86.94
UART_RX0  (via drill 0.5)
  Top 0.4: RN5.1 50.55,27.48 49.98,26.91
  Top 0.5: 49.98,26.91 49.98,7.75 51.27,6.46
  Top 1: 51.27,6.46 J7.12 v51.27,1.94
  Bottom 1: J7.12 v51.27,1.94
UART_RX1  (via drill 0.5)
  Top 0.4: RN5.3 52.15,27.11 52.51,26.76
  Top 0.5: 52.51,26.76 52.51,7.71 53.81,6.41
  Top 1: 53.81,6.41 J7.14 v53.81,1.94
  Bottom 1: J7.14 v53.81,1.94
UART_RX2  (via drill 0.5)
  Top 0.4: RN6.1 54.3,27.93 55.03,27.2
  Top 0.5: 55.03,27.2 55.03,7.78 56.35,6.46
  Top 1: 56.35,6.46 J7.16 v56.35,1.94
  Bottom 1: J7.16 v56.35,1.94
UART_RX3  (via drill 0.5)
  Top 0.4: RN6.3 55.9,29.27 57.59,27.58
  Top 0.5: 57.59,27.58 57.59,7.78 58.89,6.49
  Top 1: 58.89,6.49 J7.18 v58.89,1.94
  Bottom 1: J7.18 v58.89,1.94
UART_TX0  (via drill 0.5)
  Top 0.4: RN5.2 51.35,26.61 51.27,26.53
  Top 0.5: 51.27,26.53 J7.11
  Top 1: J7.11 v51.27,8.34
  Bottom 1: J7.11 v51.27,8.34
UART_TX1  (via drill 0.5)
  Top 0.4: RN5.4 52.95,27.72 53.81,26.86
  Top 0.5: J7.13 53.81,26.86
  Top 1: J7.13 v53.81,8.35 v53.8,8.34
  Bottom 0.5: v53.81,8.35 v53.8,8.34
  Bottom 1: J7.13 v53.81,8.35
UART_TX2  (via drill 0.5)
  Top 0.4: RN6.2 55.1,28.69 56.35,27.44
  Top 0.5: J7.15 56.35,27.44
  Top 1: J7.15 v56.35,8.34
  Bottom 1: J7.15 v56.35,8.34
UART_TX3  (via drill 0.5)
  Top 0.4: RN6.4 56.7,29.98 58.89,27.79
  Top 0.5: J7.17 58.89,27.79
  Top 1: J7.17 v58.89,8.35 v58.88,8.34
  Bottom 0.5: v58.89,8.35 v58.88,8.34
  Bottom 1: J7.17 v58.89,8.35
VBAT  (via drill 0.5)
  Top 0.5: U$3.6 49.13,75.56 47.98,76.72 46.59,76.72
  Top 1.016: v65,81 46.88,81 46.19,80.31 46.19,77.12 46.59,76.72
  Bottom 0.5: R15.1 76.61,27.55
  Bottom 0.8: 76.61,27.55 D1.C
  Bottom 1: v65,81 77.95,68.05 77.95,38.88 76.61,37.53 D1.C
VCAP
  Bottom 0.5: C15.+ 76.64,23.16
  Bottom 0.8: 76.64,23.16 R15.2
XIN
  Top 0.3: IC1.51 57.94,44 61.63,40.31 Y1.P$2
XOUT
  Top 0.3: IC1.50 56,42.06 59.69,38.37 Y1.P$1

### Text on the board
tPlace: uSD | FLASH_B | RAM_B | FLASH_A | RAM_A | RedQueen2 / DPU v0.2 / 05.04.2021 / D.Madlener